# EAGLE design Adafruit PyPortal Pynt (EAGLE 9.4.2)

## Sheet 1 of 3
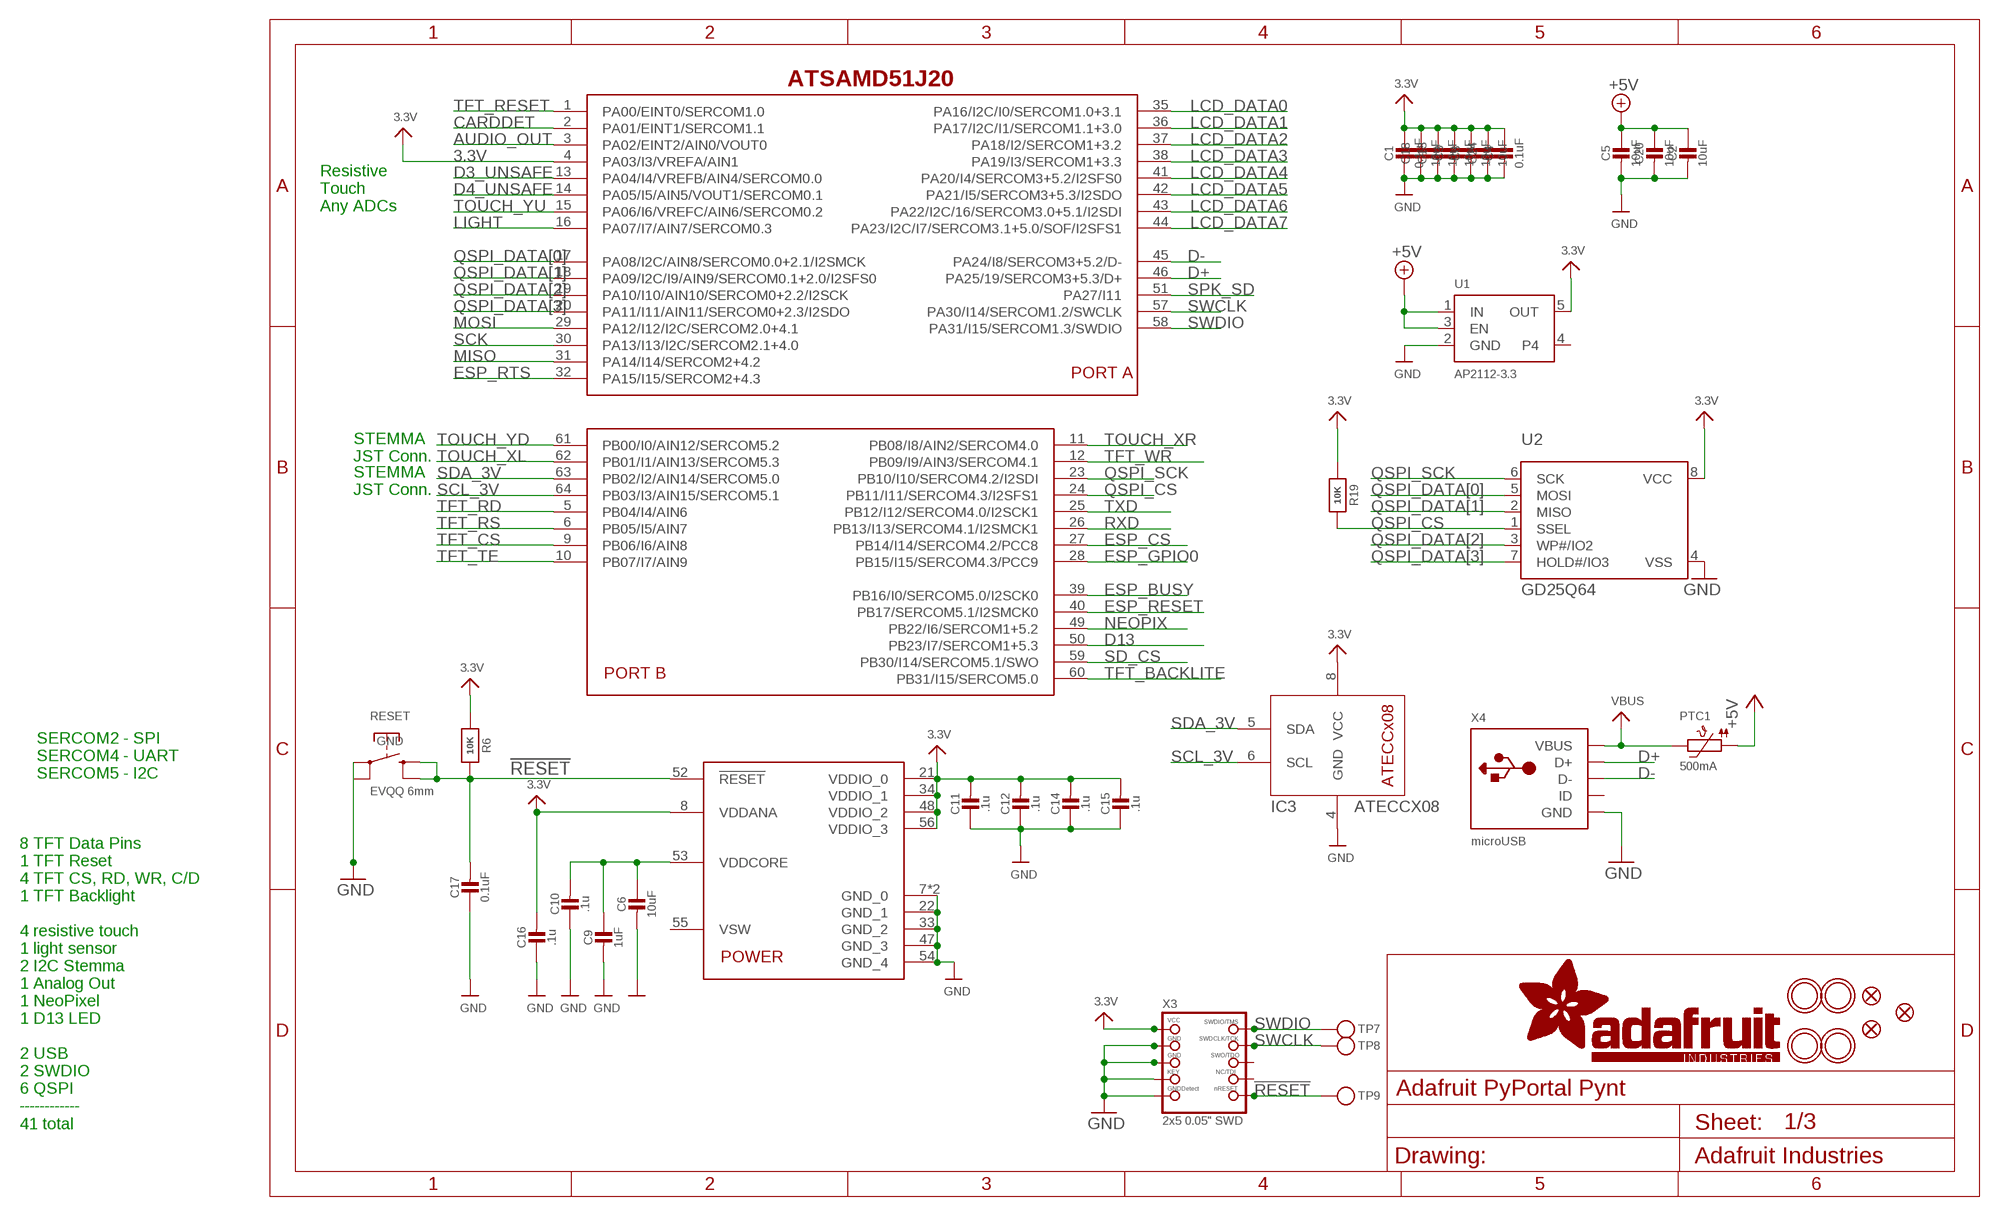
[diagram p0: schematic, sheet 1]

### Parts
C1  0.1uF  CAP_CERAMIC0603_NO  [0603-NO]
C2  10uF  CAP_CERAMIC0805-NOOUTLINE  [0805-NO]
C3  10uF  CAP_CERAMIC0805-NOOUTLINE  [0805-NO]
C4  0.1uF  CAP_CERAMIC0805-NOOUTLINE  [0805-NO]
C5  10uF  CAP_CERAMIC0805-NOOUTLINE  [0805-NO]
C6  10uF  CAP_CERAMIC0805-NOOUTLINE  [0805-NO]
C8  10uF  CAP_CERAMIC0805-NOOUTLINE  [0805-NO]
C9  1uF  CAP_CERAMIC0603_NO  [0603-NO]
C10  .1u  CAP_CERAMIC0603_NO  [0603-NO]
C11  .1u  CAP_CERAMIC0603_NO  [0603-NO]
C12  .1u  CAP_CERAMIC0603_NO  [0603-NO]
C13  10uF  CAP_CERAMIC0805-NOOUTLINE  [0805-NO]
C14  .1u  CAP_CERAMIC0603_NO  [0603-NO]
C15  .1u  CAP_CERAMIC0603_NO  [0603-NO]
C16  .1u  CAP_CERAMIC0603_NO  [0603-NO]
C17  0.1uF  CAP_CERAMIC0603_NO  [0603-NO]
C18  10uF  CAP_CERAMIC0805-NOOUTLINE  [0805-NO]
C20  10uF  CAP_CERAMIC0805-NOOUTLINE  [0805-NO]
C24  10uF  CAP_CERAMIC0805-NOOUTLINE  [0805-NO]
IC3  ATECCX08  [SOIC8_150MIL]
PTC1  500mA  PTC1206  [1206]
R6  10K  RESISTOR_0603_NOOUT  [0603-NO]
R19  10K  RESISTOR_0603_NOOUT  [0603-NO]
RESET  EVQQ 6mm  SWITCH_TACT_SMT_EVQQ2_SMALL  [EVQ-Q2_SMALLER]
TP7  TESTPOINTROUND1.5MM  [TESTPOINT_ROUND_1.5MM]
TP8  TESTPOINTROUND1.5MM  [TESTPOINT_ROUND_1.5MM]
TP9  TESTPOINTROUND1.5MM  [TESTPOINT_ROUND_1.5MM]
U1  AP2112-3.3  VREG_SOT23-5  [SOT23-5]
U2  GD25Q64  SPIFLASH_8PIN208MIL  [SOIC8_208MIL]
U$2  ATSAMD51J20  ATSAMD51J  [PQFN64-1]
U$7  MOUNTINGHOLE3.0THIN  [MOUNTINGHOLE_3.0_PLATEDTHIN]
U$9  FIDUCIAL_1MM  [FIDUCIAL_1MM]
U$11  FIDUCIAL_1MM  [FIDUCIAL_1MM]
U$15  MOUNTINGHOLE3.0THIN  [MOUNTINGHOLE_3.0_PLATEDTHIN]
U$16  MOUNTINGHOLE3.0THIN  [MOUNTINGHOLE_3.0_PLATEDTHIN]
U$17  MOUNTINGHOLE3.0THIN  [MOUNTINGHOLE_3.0_PLATEDTHIN]
U$23  FIDUCIAL_1MM  [FIDUCIAL_1MM]
X3  2x5 0.05" SWD  JTAG-CORTEX  [2X05_1.27MM_SMT]
X4  microUSB  USB_MICRO_NARROW  [4UCONN_20329_NARROW]

### Nets
3.3V [power]: C1.1 C3.1 C4.1 C8.1 C11.2 C12.2 C13.1 C14.2 C15.2 C16.2 C18.1 C24.1 IC3.8(VCC) R6.1 R19.1 U1.5(OUT) U2.8(VCC) U$2.4(PA03/I3/VREFA/AIN1) U$2.8(VDDANA) U$2.21(VDDIO_0) U$2.34(VDDIO_1) U$2.48(VDDIO_2) U$2.56(VDDIO_3) X3.1(VCC) ; also sheet 2,3
!RESET: C17.2 R6.2 RESET.B'(S1) RESET.B(S) TP9.P$1 U$2.52(!RESET) X3.10(NRESET)
+5V [power]: C2.1 C5.1 C20.1 PTC1.1 U1.1(IN) U1.3(EN) ; also sheet 2,3
AUDIO_OUT: U$2.3(PA02/EINT2/AIN0/VOUT0) ; also sheet 3
CARDDET: U$2.2(PA01/EINT1/SERCOM1.1) ; also sheet 2
D3_UNSAFE: U$2.13(PA04/I4/VREFB/AIN4/SERCOM0.0) ; also sheet 3
D4_UNSAFE: U$2.14(PA05/I5/AIN5/VOUT1/SERCOM0.1) ; also sheet 3
D13: U$2.50(PB23/I7/SERCOM1+5.3) ; also sheet 3
D+: U$2.46(PA25/19/SERCOM3+5.3/D+) X4.D+
D-: U$2.45(PA24/I8/SERCOM3+5.2/D-) X4.D-
ESP_BUSY: U$2.39(PB16/I0/SERCOM5.0/I2SCK0) ; also sheet 2
ESP_CS: U$2.27(PB14/I14/SERCOM4.2/PCC8) ; also sheet 2
ESP_GPIO0: U$2.28(PB15/I15/SERCOM4.3/PCC9) ; also sheet 2
ESP_RESET: U$2.40(PB17/SERCOM5.1/I2SMCK0) ; also sheet 2
ESP_RTS: U$2.32(PA15/I15/SERCOM2+4.3) ; also sheet 2
GND: C1.2 C2.2 C3.2 C4.2 C5.2 C6.2 C8.2 C9.2 C10.1 C11.1 C12.1 C13.2 C14.1 C15.1 C16.1 C17.1 C18.2 C20.2 C24.2 IC3.4(GND) RESET.A'(P1) RESET.A(P) U1.2(GND) U2.4(VSS) U$2.7(GND_0) U$2.22(GND_1) U$2.33(GND_2) U$2.47(GND_3) U$2.54(GND_4) U$2.EXP(GND_0) X3.3(GND) X3.5(GND) X3.7(KEY) X3.9(GNDDETECT) X4.BASE@1(GND) X4.BASE@2(GND) X4.GND X4.SPRT@1(GND) X4.SPRT@2(GND) X4.SPRT@3(GND) X4.SPRT@4(GND) ; also sheet 2,3
LCD_DATA0: U$2.35(PA16/I2C/I0/SERCOM1.0+3.1) ; also sheet 2
LCD_DATA1: U$2.36(PA17/I2C/I1/SERCOM1.1+3.0) ; also sheet 2
LCD_DATA2: U$2.37(PA18/I2/SERCOM1+3.2) ; also sheet 2
LCD_DATA3: U$2.38(PA19/I3/SERCOM1+3.3) ; also sheet 2
LCD_DATA4: U$2.41(PA20/I4/SERCOM3+5.2/I2SFS0) ; also sheet 2
LCD_DATA5: U$2.42(PA21/I5/SERCOM3+5.3/I2SDO) ; also sheet 2
LCD_DATA6: U$2.43(PA22/I2C/16/SERCOM3.0+5.1/I2SDI) ; also sheet 2
LCD_DATA7: U$2.44(PA23/I2C/I7/SERCOM3.1+5.0/SOF/I2SFS1) ; also sheet 2
LIGHT: U$2.16(PA07/I7/AIN7/SERCOM0.3) ; also sheet 3
MISO: U$2.31(PA14/I14/SERCOM2+4.2) ; also sheet 2
MOSI: U$2.29(PA12/I12/I2C/SERCOM2.0+4.1) ; also sheet 2
NEOPIX: U$2.49(PB22/I6/SERCOM1+5.2) ; also sheet 3
QSPI_CS: R19.2 U2.1(SSEL) U$2.24(PB11/I11/SERCOM4.3/I2SFS1)
QSPI_DATA[0]: U2.5(MOSI) U$2.17(PA08/I2C/AIN8/SERCOM0.0+2.1/I2SMCK)
QSPI_DATA[1]: U2.2(MISO) U$2.18(PA09/I2C/I9/AIN9/SERCOM0.1+2.0/I2SFS0)
QSPI_DATA[2]: U2.3(WP#/IO2) U$2.19(PA10/I10/AIN10/SERCOM0+2.2/I2SCK)
QSPI_DATA[3]: U2.7(HOLD#/IO3) U$2.20(PA11/I11/AIN11/SERCOM0+2.3/I2SDO)
QSPI_SCK: U2.6(SCK) U$2.23(PB10/I10/SERCOM4.2/I2SDI)
RXD: U$2.26(PB13/I13/SERCOM4.1/I2SMCK1) ; also sheet 2
SCK: U$2.30(PA13/I13/I2C/SERCOM2.1+4.0) ; also sheet 2
SCL_3V: IC3.6(SCL) U$2.64(PB03/I3/AIN15/SERCOM5.1) ; also sheet 3
SD_CS: U$2.59(PB30/I14/SERCOM5.1/SWO) ; also sheet 2
SDA_3V: IC3.5(SDA) U$2.63(PB02/I2/AIN14/SERCOM5.0) ; also sheet 3
SPK_SD: U$2.51(PA27/I11) ; also sheet 3
SWCLK: TP8.P$1 U$2.57(PA30/I14/SERCOM1.2/SWCLK) X3.4(SWDCLK)
SWDIO: TP7.P$1 U$2.58(PA31/I15/SERCOM1.3/SWDIO) X3.2(SWDIO)
TFT_BACKLITE: U$2.60(PB31/I15/SERCOM5.0) ; also sheet 2
TFT_CS: U$2.9(PB06/I6/AIN8) ; also sheet 2
TFT_RD: U$2.5(PB04/I4/AIN6) ; also sheet 2
TFT_RESET: U$2.1(PA00/EINT0/SERCOM1.0) ; also sheet 2
TFT_RS: U$2.6(PB05/I5/AIN7) ; also sheet 2
TFT_TE: U$2.10(PB07/I7/AIN9) ; also sheet 2
TFT_WR: U$2.12(PB09/I9/AIN3/SERCOM4.1) ; also sheet 2
TOUCH_XL: U$2.62(PB01/I1/AIN13/SERCOM5.3) ; also sheet 2
TOUCH_XR: U$2.11(PB08/I8/AIN2/SERCOM4.0) ; also sheet 2
TOUCH_YD: U$2.61(PB00/I0/AIN12/SERCOM5.2) ; also sheet 2
TOUCH_YU: U$2.15(PA06/I6/VREFC/AIN6/SERCOM0.2) ; also sheet 2
TXD: U$2.25(PB12/I12/SERCOM4.0/I2SCK1) ; also sheet 2
VBUS [power]: PTC1.2 X4.VBUS
VDDCORE: C6.1 C9.1 C10.2 U$2.53(VDDCORE)
Unconnected: U1.4 U$2.55(VSW) X3.6(SWO) X3.8(TDI) X4.ID

### Notes on the sheet
- ATSAMD51J20
- Resistive
  Touch
  Any ADCs
- STEMMA
  JST Conn.
- STEMMA
  JST Conn.
- SERCOM2 - SPI
  SERCOM4 - UART
  SERCOM5 - I2C
- 8 TFT Data Pins ✓
  1 TFT Reset
  4 TFT CS, RD, WR, C/D
  1 TFT Backlight
  
  4 resistive touch ✓
  1 light sensor ✓
  2 I2C Stemma ✓
  1 Analog Out
  1 NeoPixel
  1 D13 LED ✓
  
  2 USB ✓
  2 SWDIO ✓
  6 QSPI ✓
  ------------
  41 total

## Sheet 2 of 3
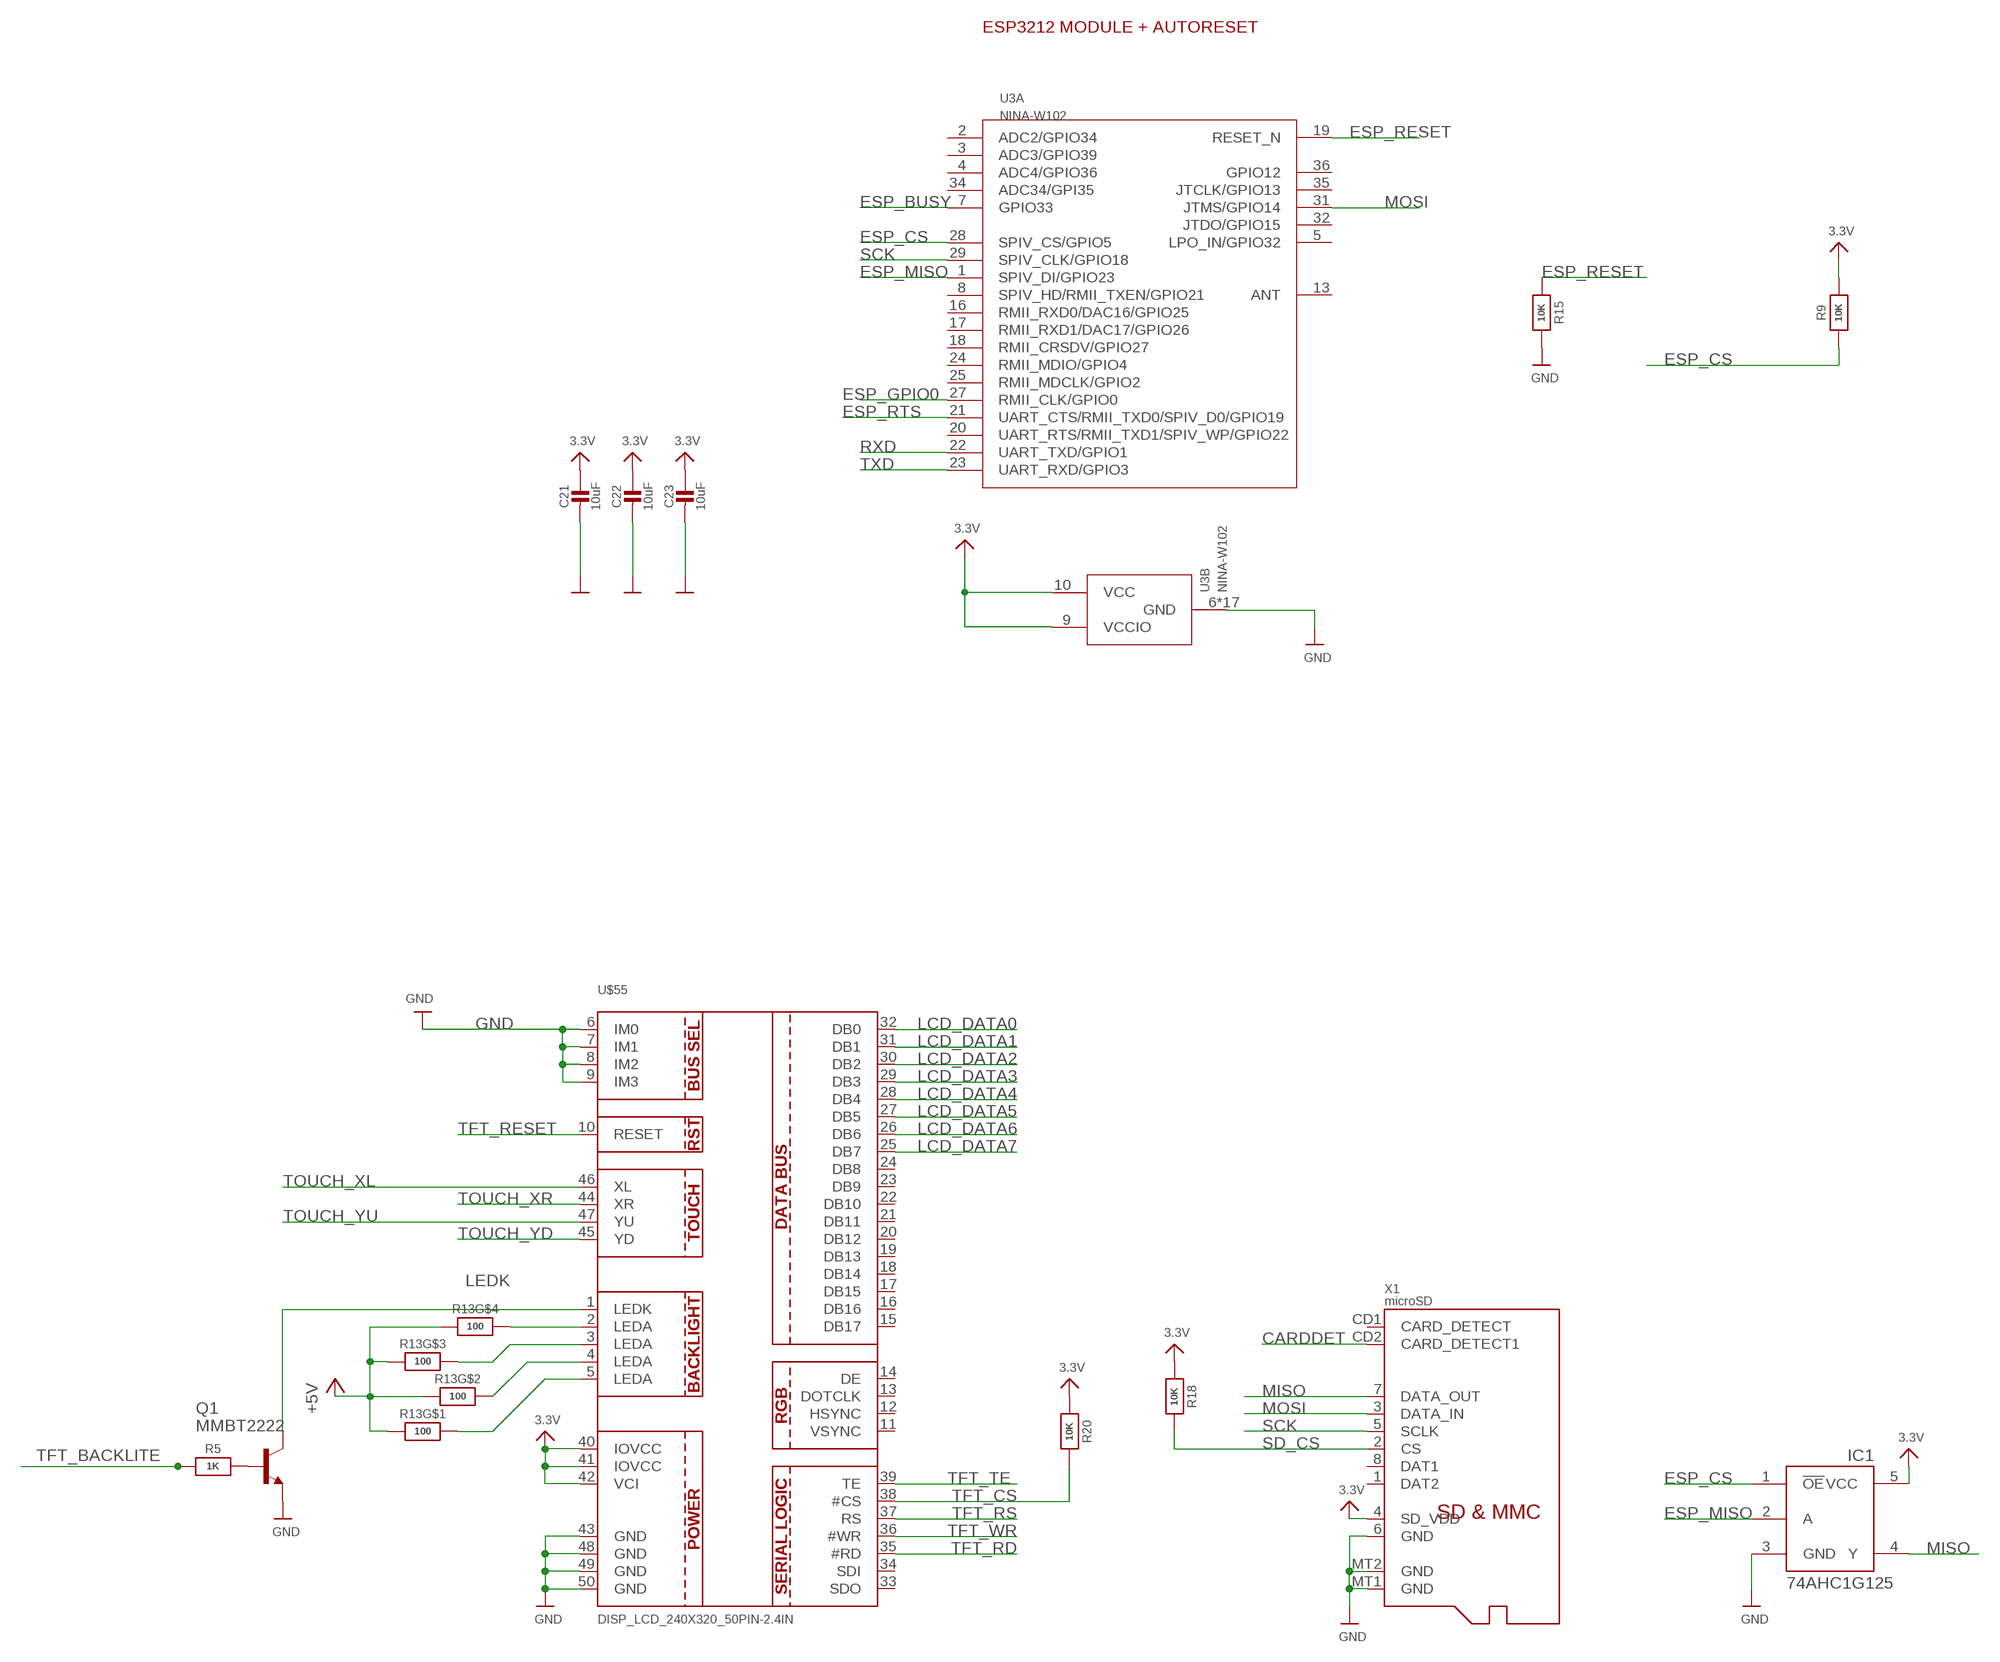
[diagram p1: schematic, sheet 2]

### Parts
C21  10uF  CAP_CERAMIC0805-NOOUTLINE  [0805-NO]
C22  10uF  CAP_CERAMIC0805-NOOUTLINE  [0805-NO]
C23  10uF  CAP_CERAMIC0805-NOOUTLINE  [0805-NO]
IC1  74AHC1G125  [SOT23-5L]
Q1  MMBT2222  MMBT2222ALT1-NPN-SOT23-BEC  [SOT23-BEC]
R5  1K  RESISTOR_0603_NOOUT  [0603-NO]
R9  10K  RESISTOR_0603_NOOUT  [0603-NO]
R13  100  RESISTOR_4PACK  [RESPACK_4X0603]
R15  10K  RESISTOR_0603_NOOUT  [0603-NO]
R18  10K  RESISTOR_0603_NOOUT  [0603-NO]
R20  10K  RESISTOR_0603_NOOUT  [0603-NO]
U3  NINA-W102  NINA-W10X-102NINA-W10X  [ARDUINO-UCS&SOCS_NINA-W1X]
U$55  DISP_LCD_240X320_50PIN-2.4IN  [TFT_2.4IN_240X320_50PIN]
X1  microSD  MICROSD  [MICROSD]

### Nets
3.3V [power]: C21.1 C22.1 C23.1 IC1.5(VCC) R9.2 R18.1 R20.1 U3.9(B:VCCIO) U3.10(B:VCC) U$55.40(IOVCC) U$55.41(IOVCC) U$55.42(VCI) X1.4(SD_VDD) ; also sheet 1,3
+5V [power]: R13.1 R13.2 R13.3 R13.4 ; also sheet 1,3
CARDDET: X1.CD2(CARD_DETECT1) ; also sheet 1
ESP_BUSY: U3.7(A:GPIO33) ; also sheet 1
ESP_CS: IC1.1(!OE) R9.1 U3.28(A:SPIV_CS/GPIO5) ; also sheet 1
ESP_GPIO0: U3.27(A:RMII_CLK/GPIO0) ; also sheet 1
ESP_MISO: IC1.2(A) U3.1(A:SPIV_DI/GPIO23)
ESP_RESET: R15.1 U3.19(A:RESET_N) ; also sheet 1
ESP_RTS: U3.21(A:UART_CTS/RMII_TXD0/SPIV_D0/GPIO19) ; also sheet 1
GND: C21.2 C22.2 C23.2 IC1.3(GND) Q1.E R15.2 U3.6(B:GND) U3.12(B:GND) U3.14(B:GND) U3.26(B:GND) U3.30(B:GND) U3.GND@1(B:GND) U3.GND@2(B:GND) U3.GND@3(B:GND) U3.GND@4(B:GND) U3.GND@5(B:GND) U3.GND@6(B:GND) U3.GND@7(B:GND) U3.GND@8(B:GND) U3.GND@9(B:GND) U3.GND@10(B:GND) U3.GND@11(B:GND) U3.GND@12(B:GND) U$55.6(IM0) U$55.7(IM1) U$55.8(IM2) U$55.9(IM3) U$55.43(GND) U$55.48(GND) U$55.49(GND) U$55.50(GND) X1.6(GND) X1.MT1(GND) X1.MT2(GND) ; also sheet 1,3
LCD_DATA0: U$55.32(DB0) ; also sheet 1
LCD_DATA1: U$55.31(DB1) ; also sheet 1
LCD_DATA2: U$55.30(DB2) ; also sheet 1
LCD_DATA3: U$55.29(DB3) ; also sheet 1
LCD_DATA4: U$55.28(DB4) ; also sheet 1
LCD_DATA5: U$55.27(DB5) ; also sheet 1
LCD_DATA6: U$55.26(DB6) ; also sheet 1
LCD_DATA7: U$55.25(DB7) ; also sheet 1
LEDK: Q1.C U$55.1(LEDK)
MISO: IC1.4(Y) X1.7(DATA_OUT) ; also sheet 1
MOSI: U3.31(A:JTMS/GPIO14) X1.3(DATA_IN) ; also sheet 1
N$1: R13.8 U$55.5(LEDA)
N$2: R13.5 U$55.2(LEDA)
N$3: R13.6 U$55.3(LEDA)
N$4: R13.7 U$55.4(LEDA)
N$16: Q1.B R5.2
RXD: U3.22(A:UART_TXD/GPIO1) ; also sheet 1
SCK: U3.29(A:SPIV_CLK/GPIO18) X1.5(SCLK) ; also sheet 1
SD_CS: R18.2 X1.2(CS) ; also sheet 1
TFT_BACKLITE: R5.1 ; also sheet 1
TFT_CS: R20.2 U$55.38(#CS) ; also sheet 1
TFT_RD: U$55.35(#RD) ; also sheet 1
TFT_RESET: U$55.10(RESET) ; also sheet 1
TFT_RS: U$55.37(RS) ; also sheet 1
TFT_TE: U$55.39(TE) ; also sheet 1
TFT_WR: U$55.36(#WR) ; also sheet 1
TOUCH_XL: U$55.46(XL) ; also sheet 1
TOUCH_XR: U$55.44(XR) ; also sheet 1
TOUCH_YD: U$55.45(YD) ; also sheet 1
TOUCH_YU: U$55.47(YU) ; also sheet 1
TXD: U3.23(A:UART_RXD/GPIO3) ; also sheet 1
Unconnected: U3.2(A:ADC2/GPIO34) U3.3(A:ADC3/GPIO39) U3.4(A:ADC4/GPIO36) U3.5(A:LPO_IN/GPIO32) U3.8(A:SPIV_HD/RMII_TXEN/GPIO21) U3.13(A:ANT) U3.16(A:RMII_RXD0/DAC16/GPIO25) U3.17(A:RMII_RXD1/DAC17/GPIO26) U3.18(A:RMII_CRSDV/GPIO27) U3.20(A:UART_RTS/RMII_TXD1/SPIV_WP/GPIO22) U3.24(A:RMII_MDIO/GPIO4) U3.25(A:RMII_MDCLK/GPIO2) U3.32(A:JTDO/GPIO15) U3.34(A:ADC34/GPI35) U3.35(A:JTCLK/GPIO13) U3.36(A:GPIO12) U$55.11(VSYNC) U$55.12(HSYNC) U$55.13(DOTCLK) U$55.14(DE) U$55.15(DB17) U$55.16(DB16) U$55.17(DB15) U$55.18(DB14) U$55.19(DB13) U$55.20(DB12) U$55.21(DB11) U$55.22(DB10) U$55.23(DB9) U$55.24(DB8) U$55.33(SDO) U$55.34(SDI) X1.1(DAT2) X1.8(DAT1) X1.CD1(CARD_DETECT)

### Notes on the sheet
- ESP3212 MODULE + AUTORESET

## Sheet 3 of 3
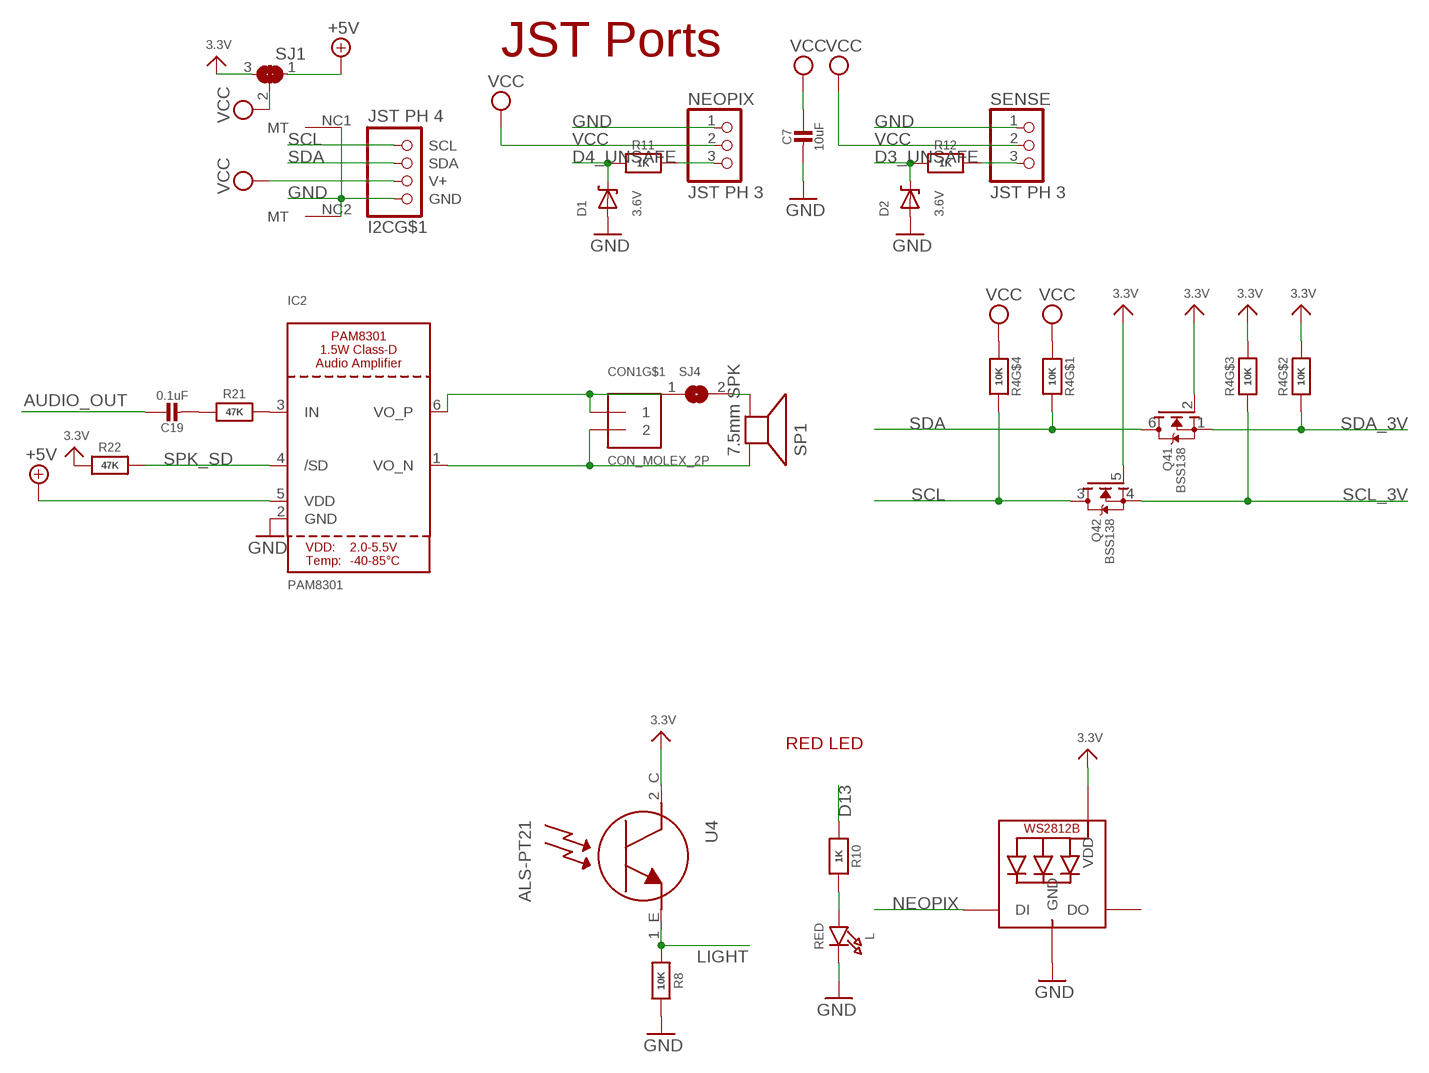
[diagram p2: schematic, sheet 3]

### Parts
C7  10uF  CAP_CERAMIC0805-NOOUTLINE  [0805-NO]
C19  0.1uF  CAP_CERAMIC0603_NO  [0603-NO]
CON1  CON_MOLEX_2P  [53398-0271]
D1  3.6V  DIODE-ZENERSOD323  [SOD-323]
D2  3.6V  DIODE-ZENERSOD323  [SOD-323]
I2C  JST PH 4  STEMMA_I2C_RASMT  [JSTPH4]
IC2  PAM8301  [SOT23-6]
L  RED  LED0805_NOOUTLINE  [CHIPLED_0805_NOOUTLINE]
LED1  WS2812B3535  [LED3535]
NEOPIX  JST PH 3  CON_JST_PH_3PIN  [JSTPH3]
Q4  BSS138  MOSFET-N_DUAL  [SOT363]
R4  10K  RESISTOR_4PACK  [RESPACK_4X0603]
R8  10K  RESISTOR_0603_NOOUT  [0603-NO]
R10  1K  RESISTOR_0603_NOOUT  [0603-NO]
R11  1K  RESISTOR_0603_NOOUT  [0603-NO]
R12  1K  RESISTOR_0603_NOOUT  [0603-NO]
R21  47K  RESISTOR_0603_NOOUT  [0603-NO]
R22  47K  RESISTOR_0603_NOOUT  [0603-NO]
SENSE  JST PH 3  CON_JST_PH_3PIN  [JSTPH3]
SJ1  SOLDERJUMPER_2WAY  [SOLDERJUMPER_2WAY_OPEN_NOPASTE]
SJ4  SOLDERJUMPERCLOSED  [SOLDERJUMPER_CLOSEDWIRE]
SP1  7.5mm SPK  SPEAKER_7.5MM  [BUZZER_SMT_7.5MM]
U4  ALS-PT21  PHOTOTRANSISTOR_PT26-21C  [ALS-PT26-21C]

### Nets
3.3V [power]: LED1.2(VDD) Q4.2(1:G) Q4.5(2:G) R4.2 R4.3 R22.1 SJ1.3 U4.2_C(C) ; also sheet 1,2
+5V [power]: IC2.5(VDD) SJ1.1 ; also sheet 1,2
AUDIO_OUT: C19.1 ; also sheet 1
D3: R12.1 SENSE.3
D3_UNSAFE: D2.C R12.2 ; also sheet 1
D4: NEOPIX.3 R11.1
D4_UNSAFE: D1.C R11.2 ; also sheet 1
D13: R10.1 ; also sheet 1
GND: C7.2 D1.A D2.A I2C.1(GND) I2C.NC1(MT) I2C.NC2(MT) IC2.2(GND) L.C LED1.4(GND) NEOPIX.1 R8.1 SENSE.1 ; also sheet 1,2
LIGHT: R8.2 U4.1_E(E) ; also sheet 1
N$8: L.A R10.2
N$10: C19.2 R21.1
N$11: IC2.3(IN) R21.2
N$13: SJ4.2 SP1.-
NEOPIX: LED1.1(DI) ; also sheet 1
SCL: I2C.4(SCL) Q4.3(2:D) R4.5
SCL_3V: Q4.4(2:S) R4.6 ; also sheet 1
SDA: I2C.3(SDA) Q4.6(1:D) R4.8
SDA_3V: Q4.1(1:S) R4.7 ; also sheet 1
SPK_SD: IC2.4(/SD) R22.2 ; also sheet 1
SPKR+: CON1.2 IC2.1(VO_N) SP1.+
SPRK-: CON1.1 IC2.6(VO_P) SJ4.1
VCC: C7.1 I2C.2(V+) NEOPIX.2 R4.1 R4.4 SENSE.2 SJ1.2
Unconnected: CON1.M1(MT) CON1.M2(MT) LED1.3(DO)

### Notes on the sheet
- JST Ports
- RED LED

## Library data of the parts
C1-C24 = microbuilder:CAP_CERAMIC: Ceramic Capacitors For new designs, use the packages preceded by an '_' character since they are more reliable: The following footprints should be used on most boards: _0402 - Standard footprint for regular board layouts _0603 - Standard footprint for regular board layouts _0805 - Standard footprint for regular board layouts _1206 - Standard footprint for regular board layouts For extremely tight-pitch boards where space is at a premium, the following 'micro-pitch' footprints can be used (smaller pads, no silkscreen outline, etc.): _0402MP - Micro-pitch footprint for very dense/compact boards _0603MP - Micro-pitch footprint for very dense/compact boards _0805MP - Micro-pitch footprint for very dense/compact boards _1206MP - Micro-pitch footprint for very dense/compact boards
CON1 = microbuilder:CON_MOLEX_2P
D1 D2 = microbuilder:DIODE-ZENER: Zener Diode SMA: 30V 1W Zener Diode, 1.2Vf - Digikey: SMAZ30-FDICT-ND
I2C = microbuilder:STEMMA_I2C
IC1 = adafruit:74AHC1G125
IC2 = microbuilder:PAM8301
IC3 = microbuilder:ATECCX08
L = microbuilder:LED: LED 0603 - 0603 Surface Mount Package 2mA: Green LED - Low Power (3.9mcd, 2ma, 1.7Vf) - Digikey: 475-2709-2-ND Orange LED - Low Power (9.8mcd, 2ma, 1.8Vf) - Digikey: 475-1194-2-ND Red LED - Low Power (5mcd, 2ma, 1.8Vf) - Digikey: 475-1195-2-ND Yellow LED - Low Power (7mcd, 2ma, 1.8Vf) - Digikey: 475-1196-2-ND 5mA: Blue LED - Low Power (17mcd, 5ma, 2.9Vf) - Digikey: LNJ937W8CRACT-ND 0805 - 0805 Surface Mount Package 2mA: Red LED (8.8mcd, 2mA, 1.8Vf, Clear) - Low Power [Digikey: 475-2510-1-ND] Green LED (5mcd, 2mA, 1.8Vf, Clear) - Low Power [Digikey: 475-2730-1-ND] Yellow LED (11.3mcd, 2mA, 1.8Vf, Clear) - Low Power [Digikey: 475-2555-1-ND] 20mA: Red LED (104mcd, 20mA, Diffused) - LS R976 [Digikey: 475-1278-6-ND] Red LED (12mcd, 20mA, 2.0Vf, Clear) - APT2012EC [Digikey: 754-1128-1-ND] Green LED (15mcd, 20mA, 2.2Vf, Clear) - APT2012GC [Digikey: 754-1131-1-ND] Orange LED (160mcd, 20mA, 2.1Vf, Clear) - APT2012SECK [Digikey: 754-1130-1-ND] 1206 - 1206 Surface Mount Package Green LED (26mcd, 20mA, Diffused) - LG N971 [Digikey: 475-1407-6-ND] Red LED (15mcd, 20mA, Diffused) - LH N974 [Digikey: 475-1416-6-ND] Cree - Cree High-Power Surface Mount LEDs XPEBWT-L1-0000-00D50 - White 111lm 350mA 2.9Vf 6200K 110° XTEAWT-00-0000-00000LEE3 - White 114lm 350mA 2.85Vf 5000K 115° Everlight - Everlight 45-21 Series Surface Mount LEDs 45-21/QK2C-B2832AC2CB2/2T - Warm White 2000mcd 20mA 3.25Vf 3050K 120° 45-21/LK2C-B38452C4CB2/2T - Nuetral White 2000mcd 20mA 3.25Vf 4150K 120° 45-21/LK2C-B50634C6CB2/2T - Cold White 2200mcd 20mA 3.25Vf 5650K 120° PLCC2 Reverse Mount LS T77K-J1L2-1-0-2-R18-Z - Red 11.25mcd 2mA 1.8Vf 630nm 120° LO T77K-L1M2-24-Z - Orange 19.6mcd 2mA 1.8Vf 606nm 120° LY T77K-K2M1-26-Z - Yellow 15.7mcd 2mA 1.8Vf 587nm 120°
LED1 = microbuilder:WS2812B
NEOPIX SENSE = microbuilder:CON_JST_PH_3PIN
PTC1 = microbuilder:PTC: PTC (Resettable Fuse) 1206 Package 250mA PTC (16V Max, Time-to-Trip: 0.08s) - Digikey: F2110CT-ND 1210 Package 100mA PTC (30V Max, Time-to-Trip: 0.6s) - Digikey: MF-USMF010-2CT-ND 1812 Package 750mA PTC (24V Max, Time-to-Trip: 0.2s) - Digikey: MF-MSMF075/24-2CT-ND
Q1 = transistor-neu-to92:*-NPN-: NPN Transistror
Q4 = microbuilder:MOSFET-N_DUAL: Dual N-Channel MOSFET SOT363 (2.0x1.25mm) 2N7002PS - 60V, 320mA [Digikey: 568-5984-1-ND]
R4 R13 = microbuilder:RESISTOR_4PACK: Resistor Packs (4 resistors) 4 x 0603 10K 1/16W - Digikey: YC164J-10KCT-ND
R5 R6 R8-R12 R15 R18-R22 = microbuilder:RESISTOR: Resistors For new designs, use the packages preceded by an '_' character since they are more reliable: The following footprints should be used on most boards: _0402 - Standard footprint for regular board layouts _0603 - Standard footprint for regular board layouts _0805 - Standard footprint for regular board layouts _1206 - Standard footprint for regular board layouts For extremely tight-pitch boards where space is at a premium, the following 'micro-pitch' footprints can be used (smaller pads, no silkscreen outline, etc.): _0402MP - Micro-pitch footprint for very dense/compact boards _0603MP - Micro-pitch footprint for very dense/compact boards _0805MP - Micro-pitch footprint for very dense/compact boards _1206MP - Micro-pitch footprint for very dense/compact boards
RESET = microbuilder:SWITCH_TACT_SMT: SMT Tact Switches 6x6mm - Digikey: P12940SCT-ND KMR2 (4.6x2.8mm) - Digikey: 401-1426-1-ND EVQ-PQHB55 - Light Touch, 160GF (4.5x4.5mm) - Digikey: P8090SCT-ND KMT0 - KMT021 NGJ LHS (etc.) IP68/Waterproof - Digikey: CKN10289CT-ND
SJ1 = microbuilder:SOLDERJUMPER_2WAY: 2-Way Solder Jumper
SJ4 = microbuilder:SOLDERJUMPER: SMD Solder JUMPER Solder the two pads together to create a connection, or remove the solder to break it. REFLOW - Use this footprint for solder paste and reflow ovens. WAVE - Use this footprint for hand-soldering (larger pads). CLOSED - Has a trace between the two pads to ensure it is closed by default. The trace needs to be cut to disable the jumper, and can be closed again by creating a solder bridge between the two pads.
SP1 = microbuilder:SPEAKER: SPEAKER Source: Buerklin Added PS12 (for part # PS1240 piezo) http://www.ladyada.net/library/pcb/eaglelibrary.html
TP7-TP9 = microbuilder:TESTPOINT: Test Point Various test points for characterisation and PCB testing TESTPOINT_SMT - Compact Surface Mount Test Point [Digikey: 5016KTR-ND]
U1 = microbuilder:VREG_SOT23-5: SOT23-5 Fixed Voltage Regulators Part Current Out V Out V In V Dropout θJA (°C/W) TJ (°C) Digikey Part No. ADP121 150mA 3.3V 3.4-5.5V 0.09V @ 150mA -- -- ADP121-AUJZ33R7CT-ND ADP121 150mA 3.0V 3.1-5.5V 0.09V @ 150mA -- -- ADP121-AUJZ30R7CT-ND ADP122 300mA 3.3V 3.4-5.5V 0.085V @ 300mA -- -- ADP122AUJZ-3.3-R7CT-ND ADP1712 300mA 3.3V 3.5-5.5V 0.17V @ 300mA -- -- ADP1712AUJZ-3.3-R7TR-ND AP7311 (Low Cost) 150mA 3.3V 3.5-6V 0.15V @ 150mA -- -- AP7311-33WG-7DICT-ND LD39015M18R 150mA 1.8V 1.9V-5.5V 0.08V @ 100mA -- -- 497-6977-1-ND LP2985A-33DBVR 150mA 3.3V 3.3-16V 0.28V @ 150mA 206 150 296-18479-1-ND MCP1824T-3302E/OT 300mA 3.3V 3.5V-6V 0.2V @ 300mA -- -- MCP1824T-3302E/OTCT-ND MIC5205-2.5YM5 TR 150mA 2.5V 2.7-16V 0.165V @ 150mA -- -- 576-1257-2-ND MIC5205-3.0YM5 TR 150mA 3.0V 3.2V-16V 0.165V @ 150mA -- -- 576-1258-2-ND MIC5205-3.3YM5 TR 150mA 3.3V 3.5V-16V 0.165V @ 150mA -- -- 576-1259-2-ND TPS780330220 150mA 3.3V+2.2V 3.6-5.5V 250mV Max -- -- 296-23332-1-ND TDA3663/N1,135 100mA 3.3V 3.5-45V 0.18V @ 50mA -- -- 568-5343-1-ND Max operating temp can be calculated using θJA, TJ (max junction temperature), and power in watts. Set the "Maximum Ambient Temperature" until it reaches TJ ("Max Junction Temperature"), which is the absolute limit for safe use of the regulator: Heat Sink Temperature Calculator <http://www.daycounter.com/Calculators/Heat-Sink-Temperature-Calculator.phtml> For example, With 12V source into a 3.3V LP2985 and a 30mA load, we are dissipating (12V-3.3V) * 0.03A = 0.261W. With a θJA of 206 °C/W, a TJ of 150°C, and 261mW we can safely use the chip without a heat sink up to 75°C (=147.1°C Junction Temperature).
U2 = microbuilder:SPIFLASH_8PIN: SOIC8 SPI Flash Be careful with the size since SOIC8 flash comes in several 'widths' SOIC8 150 mil M25P16 - 16Mbit (2Mbit x 8) Serial Flash (75MHz SPI Bus), Supply: 2.7-3.6V Digikey: SOIC8 - M25P16-VMN6P-ND SOIC8 208 mil W25Q16BVSSIG - 16Mbit (2Mbit x 8) Serial Flash (104MHz SPI Bus), Supply: 2.7-3.6V Digikey: SOIC8 - W25Q16BVSSIG-ND
U3 = microbuilder:NINA-W10X: uBlox NINA-W10X ESP32 WiFi/BLE module Footprint, Symbol, and Object by Arturo Guadalupi for the Arduino MKRWiFi1010 https://content.arduino.cc/assets/MKRWiFi1010-reference.zip BY-SA; CODE-ARDUINO: 2205; DATASHEET: https://www.u-blox.com/sites/default/files/NINA-W1_DataSheet_%28UBX-17006694%29.pdf; DISTRIBUTOR-LINK: https://www.digikey.com/product-detail/en/u-blox-america-inc/NINA-W102/672-1070-1-ND/7931820; DISTRIBUTOR-PN: 672-1070-1-ND; MANUFACTURER: Ublocks; MANUFACTURER-PN: NINA-W102
U4 = microbuilder:PHOTOTRANSISTOR: ALS-PT19-315C - Analog Light Sensor VCC: 2.5-5.5V
U$2 = microbuilder:ATSAMD51J: ATSAMD51J cortex m4 microcontroller
U$7 U$15-U$17 = microbuilder:MOUNTINGHOLE: Mounting Hole For #2 screws (0.086"/2.18mm width, 0.094"/2.4mm hole) use 2.5mm; BOM: EXCLUDE
U$9 U$11 U$23 = microbuilder:FIDUCIAL: Fiducial Alignment Points Various fiducial points for machine vision alignment.; BOM: EXCLUDE
U$55 = microbuilder:DISP_LCD_240X320_50PIN
X1 = microbuilder:MICROSD: MicroSD/Transflash Card Holder with SPI pinout 3M: 2908-05WB-MG 4UConnector: 19656 Footprint courtesy: Adafruit Industries
X3 = microbuilder:JTAG-CORTEX: Serial Wire (SW-DP) Connector Standard 0.05" 10-pin connector is for use with the Cortex M and Cortex A SWD (serial wire debugger) interface (SW-DP) Connectors 2x05_1.27MM_SMT - Inexpensive surface-mount header with bare pins, compatible with standard 10-pin SWD cables (4UCON: 16846) 2x05_1.27MM_BOX_NOPOSTS - Polarised surface-mount box (4UCON with caps: 19735, without caps: 15117 2x05_1.27MM_BOX_POSTS - Polarised surface-mount box with mounting holes (4UCON: 20317) Pinout: http://infocenter.arm.com/help/topic/com.arm.doc.faqs/attached/13634/cortex_debug_connectors.pdf http://www.keil.com/peripherals/coresight/connectors.asp
X4 = microbuilder:USB: USB Connectors USBMINIB - Surface Mount Female Mini-B USB Connector 4UConnector: 06564

## Net classes
1 power: width 0.305 mm

## Board
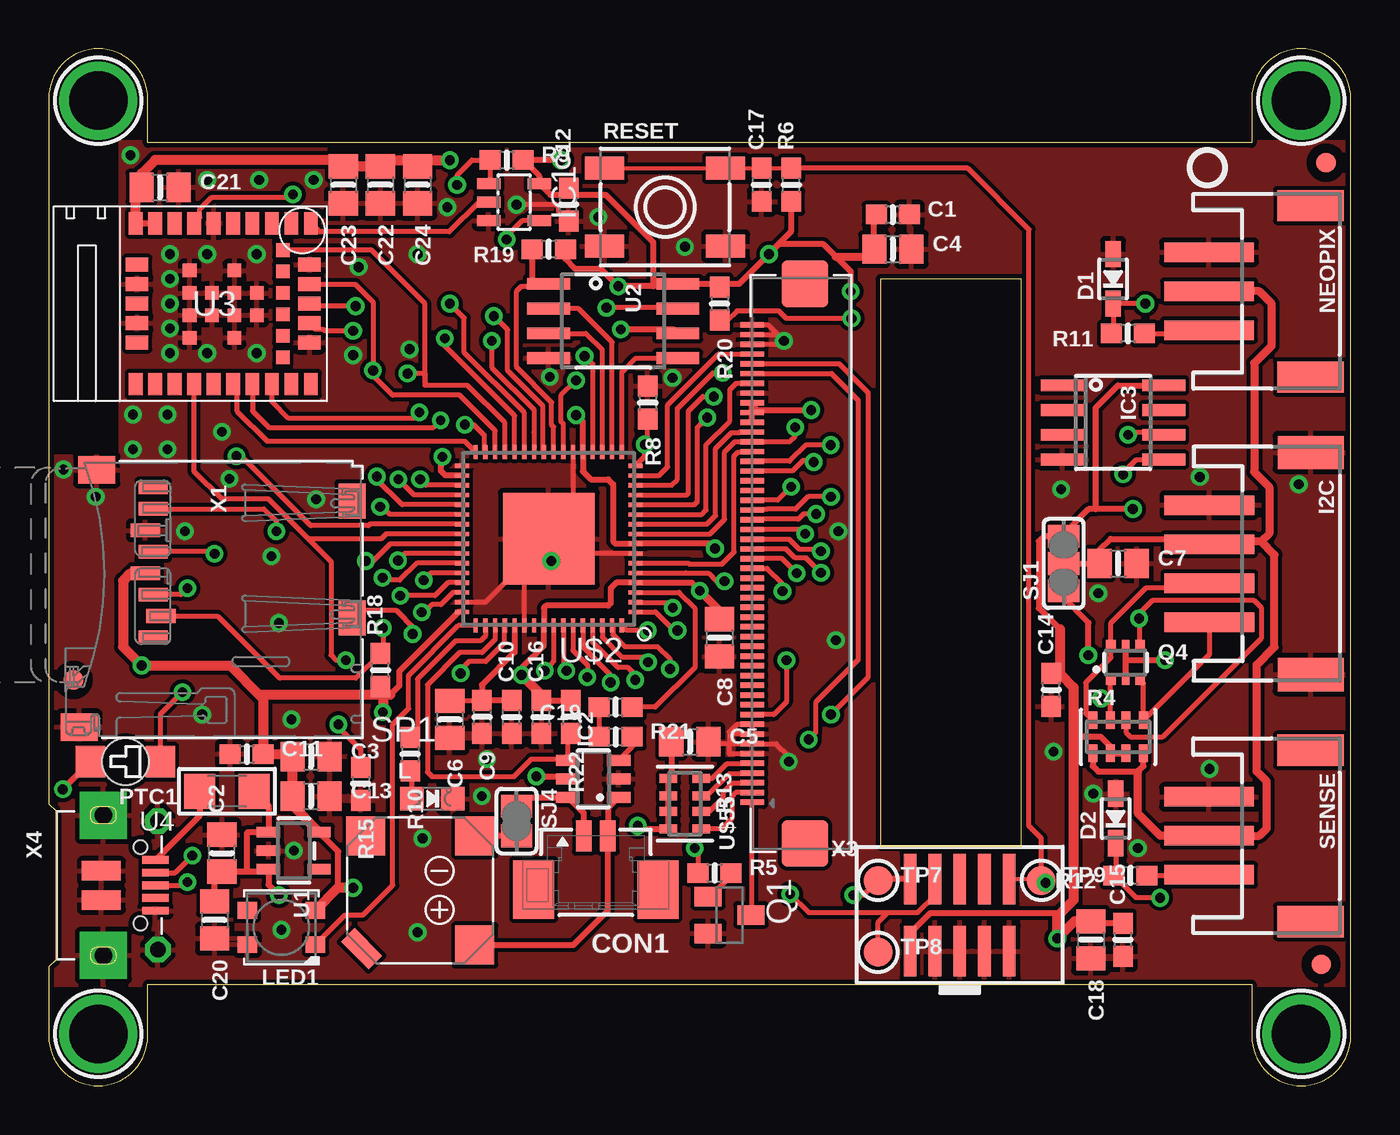
[diagram p3: board, top side]
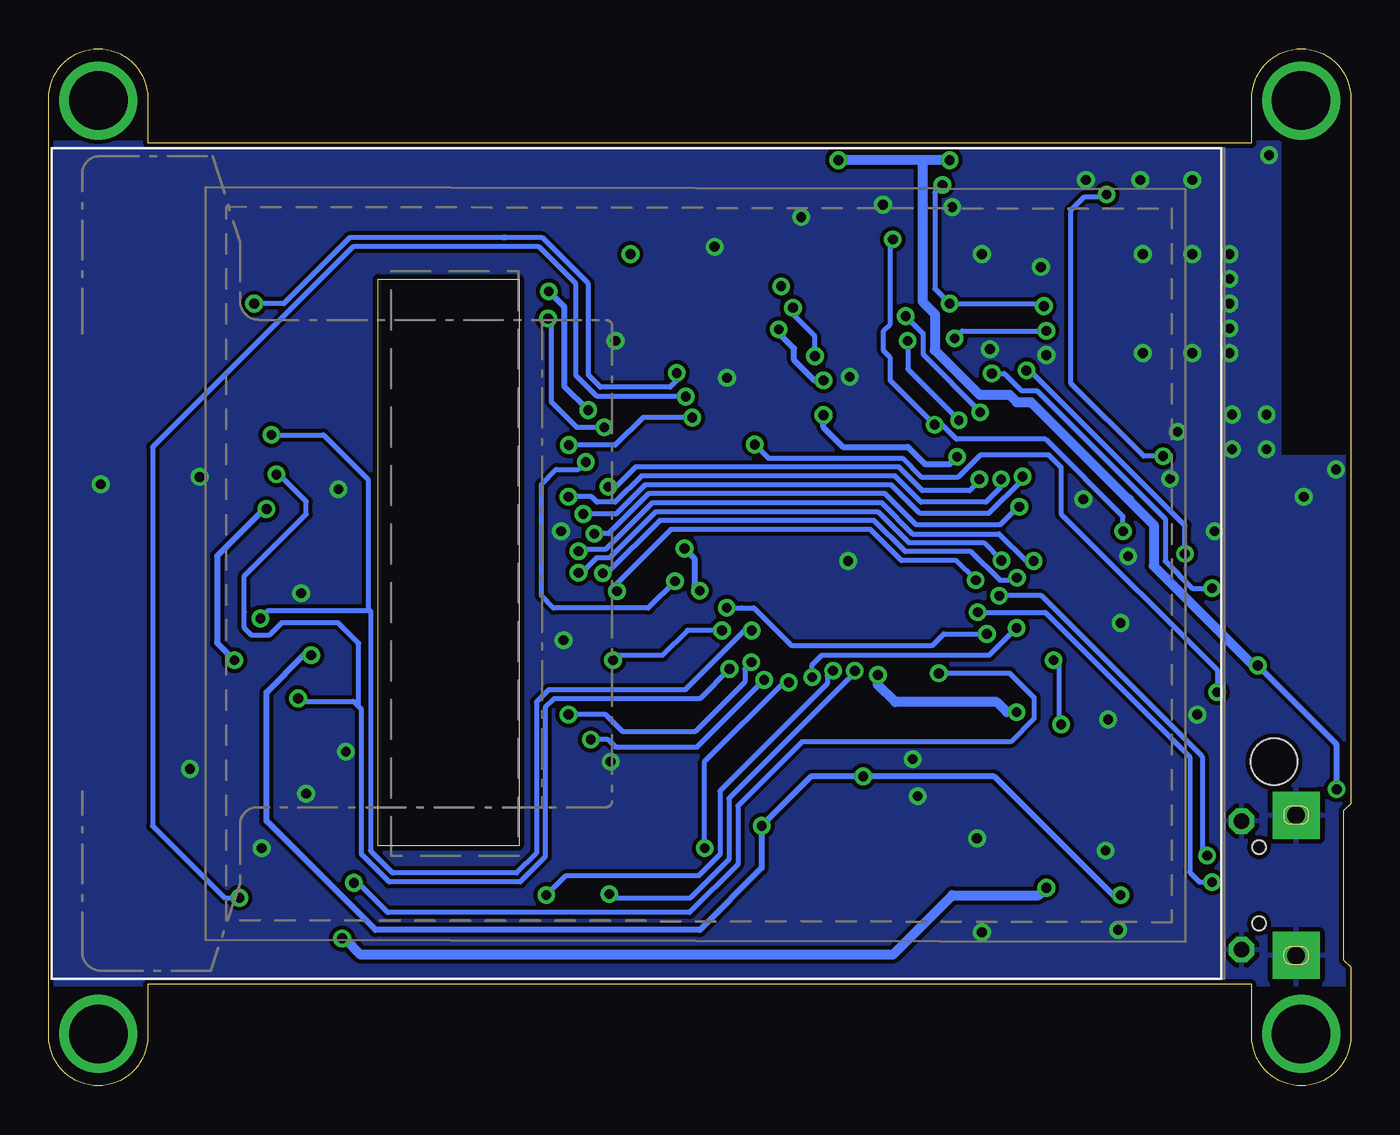
[diagram p4: board, bottom side, seen from below]

Size 66.8 x 53.21 mm. Coordinates in mm from the lower left corner, seen from the top.
Outline: 64.26,0 arc90 66.8,2.54 66.8,50.67 arc90 64.26,53.21 arc90 61.72,50.67 61.72,48.39 5.08,48.39 5.08,50.67 arc90 2.54,53.21 arc90 0,50.67 0,14.48 0.38,14.1 0.38,6.48 0,6.1 0,2.54 arc90 2.54,0 arc90 5.08,2.54 5.08,5.21 61.72,5.21 61.72,2.54 arc90 64.26,0
Outline: 42.67,12.32 49.91,12.32 49.91,41.4 42.67,41.4 42.67,12.32
Copper layers (1*16): Top 0.035mm / dielectric 1.5mm / Bottom 0.035mm
Design rules "adafruit *": minimum track width 8mil, minimum drill 19mil, track to track 8mil, track to pad 8mil, pad to pad 8mil, via to via 8mil, smd to smd 8mil, copper to edge 10mil, drill to drill 8mil, minimum pad ring 10mil, minimum via ring 8mil, stop-mask expansion 4mil, vias tented up to drill 20mil, thermal gap 10mil

### Footprints (pad centres in the part's own frame; a part is rotated, then mirrored left to right if it is on the bottom)
0603-NO = smd 1.075 x 1: 1 -0.85,0; 2 0.85,0
0805-NO = smd 1.24 x 1.5: 1 -0.95,0; 2 0.95,0
53398-0271 = smd 0.8 x 1.6: 1 0.625,-1.27; 2 -0.625,-1.27 | smd 2.1 x 3: M1 3.185,1.48; M2 -3.185,1.48
SOD-323 = smd 1.35 x 0.8: A 1.27,0; C -1.27,0
JSTPH4 = smd 1 x 4.6: 1 -3,-3.7; 2 -1,-3.7; 3 1,-3.7; 4 3,-3.7 | smd 1.7 x 3.4: NC1 -5.7,1.5; NC2 5.7,1.5
SOT23-5L = smd 0.55 x 1.2: 1 -0.95,-1.3; 2 0,-1.3; 3 0.95,-1.3; 4 0.95,1.3; 5 -0.95,1.3
SOT23-6 = smd 0.55 x 1.2: 1 -0.95,-1.3; 2 0,-1.3; 3 0.95,-1.3; 4 0.95,1.3; 5 0,1.3; 6 -0.95,1.3
SOIC8_150MIL = smd 0.6 x 2.2: 1 -1.905,-2.6; 2 -0.635,-2.6; 3 0.635,-2.6; 4 1.905,-2.6; 5 1.905,2.6; 6 0.635,2.6; 7 -0.635,2.6; 8 -1.905,2.6
CHIPLED_0805_NOOUTLINE = smd 1.2 x 1.2: A 0,-1.05; C 0,1.05
LED3535 = smd 1 x 0.85: 1 -1.75,0.875; 2 -1.75,-0.875; 3 1.75,-0.875; 4 1.75,0.875
JSTPH3 = smd 1 x 4.6: 1 -2,-2.7; 2 0,-2.7; 3 2,-2.7 | smd 1.6 x 3.4: NC1 -4.4,2.5; NC2 4.4,2.5
1206 = smd 1.6 x 1.8: 1 -1.4,0; 2 1.4,0
SOT23-BEC = smd 1 x 1.4: B -0.95,-1.1; C 0,1.1; E 0.95,-1.1
SOT363 = smd 0.5 x 0.5: 1 -0.75,-0.9; 3 0.75,-0.9; 4 0.75,0.9; 6 -0.75,0.9 | smd 0.4 x 0.5: 2 0,-0.9; 5 0,0.9
RESPACK_4X0603 = smd 0.45 x 0.9: 1 -1.3,-0.85; 2 -0.4,-0.85; 3 0.4,-0.85; 4 1.3,-0.85; 5 1.3,0.85; 6 0.4,0.85; 7 -0.4,0.85; 8 -1.3,0.85
EVQ-Q2_SMALLER = smd 2 x 1.2: A -3.1,-2; A' 3.1,-2; B -3.1,2; B' 3.1,2
SOLDERJUMPER_2WAY_OPEN_NOPASTE = smd 1.168 x 1.6: 1 -1.397,0; 2 0,0; 3 1.397,0
SOLDERJUMPER_CLOSEDWIRE = smd 1.168 x 1.6: 1 -0.762,0; 2 0.762,0 | smd 0.635 x 0.203: WIRE 0,0
BUZZER_SMT_7.5MM = smd 2 x 2: + 2.8,-2.8; - 2.8,2.8; MT2 -2.8,2.8 | smd 2 x 1 rotated 135: MT -3,-3
TESTPOINT_ROUND_1.5MM = smd 1.5 x 1.5: P$1 0,0
SOT23-5 = smd 0.55 x 1.2: 1 -0.95,-1.3; 2 0,-1.3; 3 0.95,-1.3; 4 0.95,1.3; 5 -0.95,1.3
SOIC8_208MIL = smd 0.6 x 2.2: 1 -1.905,-3.315; 2 -0.635,-3.315; 3 0.635,-3.315; 4 1.905,-3.315; 5 1.905,3.315; 6 0.635,3.315; 7 -0.635,3.315; 8 -1.905,3.315
ARDUINO-UCS&SOCS_NINA-W1X = smd 0.7 x 1.15: 1 4.95,4.125; 2 3.95,4.125; 3 2.95,4.125; 4 1.95,4.125; 5 0.95,4.125; 6 -0.05,4.125; 7 -1.05,4.125; 8 -2.05,4.125; 9 -3.05,4.125; 10 -4.05,4.125; 16 -4.05,-4.125; 17 -3.05,-4.125; 18 -2.05,-4.125; 19 -1.05,-4.125; 20 -0.05,-4.125; 21 0.95,-4.125; 22 1.95,-4.125; 23 2.95,-4.125; 24 3.95,-4.125; 25 4.95,-4.125 | smd 1.15 x 0.7: 11 -3.975,2; 12 -3.975,1; 13 -3.975,0; 14 -3.975,-1; 15 -3.975,-2; 26 4.875,-2; 27 4.875,-1; 28 4.875,0; 29 4.875,1; 30 4.875,2 | smd 0.7 x 0.7: 31 3.5,2.75; 32 3.5,1.65; 33 3.5,0.55; 34 3.5,-0.55; 35 3.5,-1.65; 36 3.5,-2.75; GND@1 -1.28,1.7; GND@2 -1.28,0.55; GND@3 -1.28,-0.6; GND@4 -1.28,-1.75; GND@5 -0.13,0.55; GND@6 -0.13,-0.6; GND@7 1.02,1.7; GND@8 1.02,0.55; GND@9 1.02,-0.6; GND@10 1.02,-1.75; GND@11 2.17,0.55; GND@12 2.17,-0.6
ALS-PT26-21C = smd 1.5 x 1.6: 1_E -1.8,0; 2_C 1.8,0 | hole 2.4: 0,0
PQFN64-1 = smd 0.7 x 0.22: 1 -4.45,3.75; 2 -4.45,3.25; 3 -4.45,2.75; 4 -4.45,2.25; 5 -4.45,1.75; 6 -4.45,1.25; 7 -4.45,0.75; 8 -4.45,0.25; 9 -4.45,-0.25; 10 -4.45,-0.75; 11 -4.45,-1.25; 12 -4.45,-1.75; 13 -4.45,-2.25; 14 -4.45,-2.75; 15 -4.45,-3.25; 16 -4.45,-3.75; 33 4.45,-3.75; 34 4.45,-3.25; 35 4.45,-2.75; 36 4.45,-2.25; 37 4.45,-1.75; 38 4.45,-1.25; 39 4.45,-0.75; 40 4.45,-0.25; 41 4.45,0.25; 42 4.45,0.75; 43 4.45,1.25; 44 4.45,1.75; 45 4.45,2.25; 46 4.45,2.75; 47 4.45,3.25; 48 4.45,3.75 | smd 0.22 x 0.7: 17 -3.75,-4.45; 18 -3.25,-4.45; 19 -2.75,-4.45; 20 -2.25,-4.45; 21 -1.75,-4.45; 22 -1.25,-4.45; 23 -0.75,-4.45; 24 -0.25,-4.45; 25 0.25,-4.45; 26 0.75,-4.45; 27 1.25,-4.45; 28 1.75,-4.45; 29 2.25,-4.45; 30 2.75,-4.45; 31 3.25,-4.45; 32 3.75,-4.45; 49 3.75,4.45; 50 3.25,4.45; 51 2.75,4.45; 52 2.25,4.45; 53 1.75,4.45; 54 1.25,4.45; 55 0.75,4.45; 56 0.25,4.45; 57 -0.25,4.45; 58 -0.75,4.45; 59 -1.25,4.45; 60 -1.75,4.45; 61 -2.25,4.45; 62 -2.75,4.45; 63 -3.25,4.45; 64 -3.75,4.45 | smd 4.7 x 4.7: EXP 0,0
MOUNTINGHOLE_3.0_PLATEDTHIN = drill 3 pad 3.6: P$1 0,0
FIDUCIAL_1MM = smd 1 x 1: 1 0,0
TFT_2.4IN_240X320_50PIN = smd 0.275 x 1.2 bottom: 1 12.25,28.551; 2 11.75,28.551; 3 11.25,28.551; 4 10.75,28.551; 5 10.25,28.551; 6 9.75,28.551; 7 9.25,28.551; 8 8.75,28.551; 9 8.25,28.551; 10 7.75,28.551; 11 7.25,28.551; 12 6.75,28.551; 13 6.25,28.551; 14 5.75,28.551; 15 5.25,28.551; 16 4.75,28.551; 17 4.25,28.551; 18 3.75,28.551; 19 3.25,28.551; 20 2.75,28.551; 21 2.25,28.551; 22 1.75,28.551; 23 1.25,28.551; 24 0.75,28.551; 25 0.25,28.551; 26 -0.25,28.551; 27 -0.75,28.551; 28 -1.25,28.551; 29 -1.75,28.551; 30 -2.25,28.551; 31 -2.75,28.551; 32 -3.25,28.551; 33 -3.75,28.551; 34 -4.25,28.551; 35 -4.75,28.551; 36 -5.25,28.551; 37 -5.75,28.551; 38 -6.25,28.551; 39 -6.75,28.551; 40 -7.25,28.551; 41 -7.75,28.551; 42 -8.25,28.551; 43 -8.75,28.551; 44 -9.25,28.551; 45 -9.75,28.551; 46 -10.25,28.551; 47 -10.75,28.551; 48 -11.25,28.551; 49 -11.75,28.551; 50 -12.25,28.551 | smd 2.4 x 2.4 bottom: PAD1 14.35,25.851; PAD2 -14.35,25.851
MICROSD = smd 0.7 x 1.5: 1 9,-10.64; 2 7.9,-10.24; 3 6.8,-10.64; 4 5.7,-11.04; 5 4.6,-10.64; 6 3.5,-11.04; 7 2.4,-10.64; 8 1.3,-10.64 | smd 1.8 x 1.4: CD1 2,-0.44; CD2 8,-0.44 | smd 1.4 x 1.9: MT1 0.4,-13.54; MT2 13.6,-14.44
2X05_1.27MM_SMT = smd 0.65 x 2.6: 1 -2.54,-1.85; 2 -2.54,1.85; 3 -1.27,-1.85; 4 -1.27,1.85; 5 0,-1.85; 6 0,1.85; 7 1.27,-1.85; 8 1.27,1.85; 9 2.54,-1.85; 10 2.54,1.85
4UCONN_20329_NARROW = smd 1 x 2: BASE@1 -0.75,-2; BASE@2 0.75,-2 | smd 0.4 x 1.35: D+ 0,0.775; D- -0.65,0.775; GND 1.3,0.775; ID 0.65,0.775; VBUS -1.3,0.775 | drill 0.8 pad 1.27 octagon: SPRT@1 -3.3,0.9; SPRT@2 3.3,0.9 | drill 0.9 pad 2.413 square: SPRT@3 -3.6,-1.9; SPRT@4 3.6,-1.9 | hole 0.7: -1.95,0; 1.95,0

### Placement (x,y rotation side)
C1  43.31,44.7 0 top
C2  8.89,11.94 90 top
C3  13.46,16.89 0 top
C4  43.31,42.93 0 top
C5  32.89,17.65 0 top
C6  20.57,18.8 270 top
C7  54.86,26.8 0 top
C8  34.42,22.99 270 top
C9  22.23,18.92 270 top
C10  23.75,18.92 90 top
C11  10.16,17.02 0 top
C12  26.67,45.21 90 top
C13  13.46,14.86 0 top
C14  51.44,20.32 90 top
C15  55.12,7.49 90 top
C16  25.27,18.92 90 top
C17  36.58,46.23 90 top
C18  53.47,7.49 270 top
C19  29.08,19.43 180 top
C20  8.51,8.51 270 top
C21  5.71,46.1 0 top
C22  17.02,46.23 270 top
C23  15.11,46.23 270 top
C24  18.92,46.23 270 top
CON1  28.07,11.56 180 top
D1  54.61,41.4 90 top
D2  54.74,13.72 90 top
I2C  63.25,26.8 270 top
IC1  23.88,45.34 270 top
IC2  27.94,15.75 90 top
IC3  54.61,34.04 270 top
L  19.68,14.73 270 top
LED1  11.94,8.13 180 top
NEOPIX  62.23,40.77 270 top
PTC1  9.14,15.11 180 top
Q1  34.92,8.76 270 top
Q4  55.24,21.72 0 top
R4  54.86,17.91 0 top
R5  34.16,10.92 0 top
R6  38.1,46.23 90 top
R8  30.73,35.05 270 top
R9  23.5,47.5 0 top
R10  18.54,17.02 270 top
R11  55.37,38.61 180 top
R12  55.5,10.79 180 top
R13  32.64,14.48 270 top
R15  16,15.49 270 top
R18  17.02,21.34 90 top
R19  25.65,42.93 180 top
R20  34.42,40.13 270 top
R21  29.08,17.91 0 top
R22  26.8,18.92 270 top
RESET  31.62,45.09 0 top
SENSE  62.23,12.83 270 top
SJ1  52.07,26.8 90 top
SJ4  24,13.59 270 top
SP1  19.05,10.03 0 top
TP7  42.55,10.54 0 top
TP8  42.55,6.86 0 top
TP9  50.93,10.54 0 top
U1  12.57,12.06 270 top
U2  28.96,39.24 270 top
U3  8.51,40.13 0 top
U4  3.94,16.64 180 top
U$2  25.65,28.07 180 top
U$7  64.26,2.67 90 top
U$9  65.53,47.37 90 top
U$11  1.27,20.83 90 top
U$15  64.26,50.55 90 top
U$16  2.54,2.67 90 top
U$17  2.54,50.55 90 top
U$19  [PYPORTALPYNT_TOP]  0,0.13 0 top
U$23  65.28,6.22 90 top
U$54  [PYPORTALPYNT_BOT]  66.8,0.13 0 bottom
U$55  64.64,26.8 270 bottom
U$63  [PCBFEAT-REV-040]  59.44,47.12 0 top
X1  16,32 270 top
X3  46.74,8.76 0 top
X4  4.7,10.29 270 top

### Tracks (layer width: path | path; a pad name or v marks a point on that pad's centre or on a via)
3.3V  (via drill 0.5)
  Top 0.305: R22.1 C16.2 25.15,19.9 25.15,20.19 | 12.51,14.38 C13.1 | 12.38,17.02 C3.1 | U1.5 14.86,12.03 14.86,10.17 | U$55.40 U$55.41 36.09,34.92 | 36.09,34.92 U$55.42 | R19.1 26.5,42.43 27.01,41.92 28.33,41.92 v29.22,41.03 31.01,41.03 | 31.01,41.03 32.15,41.03 U2.8 34.54,41.15 | v27.05,34.42 27.4,34.06 U$2.21 27.4,31.52 27.81,31.12 28.7,31.12 28.96,30.86 28.96,27.94 29.08,27.81 29.09,27.82 U$2.8 33.93,27.82 v34.18,27.57 | U$2.34 20.36,31.32 20.12,31.56 20.12,32.2 v20.19,32.28 | 31.01,41.03 31.01,43.29 28.57,45.72 26.54,45.72 25.75,45.72 IC1.5 25.18,46.67 R9.2 v26.29,47.5 | v24.26,21.08 24.26,21.46 25.4,22.6 U$2.56 25.4,24.51 25.53,24.64 28.7,24.64 28.83,24.77 28.83,25.53 29.12,25.82 U$2.4 32.98,25.82 v33.4,25.4 | U$2.48 21.03,24.32 17.98,21.27 17.98,20.52 17.53,20.07 | 34.54,41.15 35.43,41.15 v36.96,42.67 | R6.1 38.1,43.85 36.96,42.71 v36.96,42.67 | R18.1 17.14,20.36 | 36.09,34.92 36.35,34.67 v39.12,34.67 | v41.15,40.77 41.15,41.78 40.39,42.55 39.75,43.18 37.47,43.18 v36.96,42.67 | X3.1 44.2,7.83 45.24,8.87 51.92,8.87 | SJ1.3 51.94,28.19 | 51.94,28.19 51.05,28.19 50.8,27.94 50.8,24.51 51.88,23.43 | 15.61,10.17 v15.62,10.16 | 51.75,8.71 52.06,9.02 52.07,9.02 | 52.63,8.44 C18.1 53.57,8.34 C15.2 | R20.1 34.42,41.02 34.54,41.15 | U4.2_C v0.72,15.21 | Q4.5 55.24,21.84 | 55.24,21.84 Q4.2 | R4.3 R4.2 54.46,17.42 53.98,17.91 52.58,17.91 | 55.24,21.84 v57.28,21.84 | v55.63,29.59 53.72,29.59 | 53.72,29.59 53.34,29.59 51.94,28.19 | C1.1 42.32,44.57 42.32,42.89 | 53.72,29.59 53.72,34.8 54.86,35.94 IC3.8 | U3.10 U3.9 | 4.46,45.8 C21.1 4.76,46.8 | C22.1 17.34,47.5 | C23.1 14.79,47.5
  Top 0.406: C14.2 51.85,21.17 51.88,21.14 | C12.2 26.67,45.85 26.54,45.72 | 40.39,42.55 41.98,42.55 42.32,42.89 C4.1 | v33.4,25.4 34.42,24.38 C8.1
  Top 0.508: U1.5 12.51,14.38 | C13.1 C3.1 | 12.38,17.02 C11.2 11.01,19.85 10.79,20.07 | LED1.2 14.86,10.17 15.61,10.17 | 10.79,20.07 9.3,21.56 v4.77,21.56 3.81,22.53 3.81,25.91 4.21,26.3 X1.4 | R18.1 16.6,20.07 | 16.6,20.07 10.79,20.07 | 25.15,20.19 v24.26,21.08 | 17.53,20.07 16.6,20.07 | 17.14,20.36 v17.14,19.18 | 51.92,8.87 52.07,9.02 52.58,9.52 52.58,17.91 52.58,20.45 51.88,21.14 51.88,23.43 | 51.75,8.71 v51.75,7.56 52.63,8.44 | U3.10 4.46,45.8 | 4.76,46.8 5.46,47.5 14.79,47.5 | C23.1 C22.1 | 17.34,47.5 18.92,47.5 | 18.92,47.5 v20.57,47.5 | C24.1 18.92,47.5
  Bottom 0.305: v20.19,32.28 20.57,31.9 21.84,31.9 22.73,32.79 26.06,32.79 27.05,33.78 v27.05,34.42 | v33.4,25.4 33.67,25.67 33.67,27.06 v34.18,27.57 | 24.26,20.58 v24.26,21.08 | v39.12,34.67 40.36,35.92 40.36,39.98 v41.15,40.77 | v51.75,7.56 51.63,7.56 | v0.72,15.21 0.72,17.52 v4.77,21.56 | v57.28,21.84 58.17,22.73 58.17,27.18 55.75,29.59 v55.63,29.59
  Bottom 0.508: v17.14,19.18 17.65,19.18 18.16,19.68 23.37,19.68 24.26,20.58 | v15.62,10.16 16,9.78 20.45,9.78 23.5,6.73 50.8,6.73 51.63,7.56 | v20.57,47.5 21.97,47.5 | 21.97,47.5 v26.29,47.5 | 21.97,47.5 21.97,40.24 21.34,39.61 21.34,37.75 19.05,35.46 17.51,35.46 17.13,35.08 16.41,35.08 11.43,30.1 | 11.43,30.1 11.37,30.1 | 11.43,30.1 10.11,28.78 10.11,26.68 4.99,21.56 v4.77,21.56
!RESET  (via drill 0.5)
  Top 0.203: RESET.B RESET.B' C17.2 R6.2 | TP9.P$1 50.85,10.61 X3.10
  Top 0.254: v21.13,21.16 21.13,21.34 21.55,21.77 22.41,21.77 23.36,22.71 23.36,23.57 U$2.52 | v51.14,10.41 51.02,10.54 TP9.P$1 50.93,12.7 50.29,13.34 50.29,43.94 47.16,47.08 R6.2
  Bottom 0.254: v51.14,10.41 50.93,10.41 49.4,8.89 33.92,8.89 31.45,11.36 31.45,14.36 28.16,17.65 17.45,17.65 16.26,18.84 16.26,19.94 17.48,21.16 v21.13,21.16 | v21.13,21.16
+5V  (via drill 0.5)
  Top 0.305: C5.1 31.94,15.93 R13.1 R13.2 R13.3 R13.4 30.38,13.18 v30.23,13.34 | PTC1.1 11.27,14.38 U1.1 10.22,13.02 10.16,12.95 10.16,11.12 10.03,10.99 | 10.03,10.99 11.15,10.99 U1.3 11.27,10.32 v11.81,9.78 | 10.03,10.99 C2.1 8.51,10.61 C20.1 | v25.02,15.88 26.51,15.88 IC2.5 | v53.34,22.1 53.34,23.75 52.07,25.02 SJ1.1
  Bottom 0.305: v11.81,9.78 12.19,9.78 18.29,15.88 v25.02,15.88 27.69,15.88 v30.23,13.34 30.23,11.18 33.4,8 50.04,8 55.63,13.59 55.63,20.19 53.72,22.1 v53.34,22.1
AUDIO_OUT
  Top 0.254: U$2.3 32.34,25.32 33.15,24.51 33.15,21.46 | 33.15,21.46 31.11,19.43 C19.1 | 33.15,21.46
CARDDET  (via drill 0.5)
  Top 0.254: U$2.2 30.15,24.77 31.78,24.77 v32.02,24.53 | v18.67,23.19 18.67,23.55 18.31,23.91 18.31,23.93 17.85,24.38 15.94,24.38 X1.CD2
  Bottom 0.254: v32.02,24.53 31.24,24.53 30.62,24.53 28.7,22.61 21.46,22.61 20.88,23.19 v18.67,23.19 | v32.02,24.53
D3
  Top 0.254: R12.1 59.5,10.79 SENSE.3
D3_UNSAFE  (via drill 0.5)
  Top 0.254: U$2.13 32.73,30.32 32.82,30.4 32.82,34.62 33.56,35.37 v34.12,35.37 | D2.C 54.74,10.88 R12.2 55.8,9.65 v57.02,9.65
  Bottom 0.254: v34.12,35.37 38.67,35.37 39.75,36.45 39.75,41.15 41.66,43.05 51.18,43.05 61.47,32.77 61.47,13.34 57.78,9.65 v57.02,9.65
D4
  Top 0.254: NEOPIX.3 59.37,38.61 R11.1
D4_UNSAFE  (via drill 0.5)
  Top 0.254: U$2.14 31.96,30.82 32.26,31.12 32.26,34.76 34.07,36.58 v34.58,36.58 | v56.26,40.13 D1.C 54.61,38.7 R11.2
  Bottom 0.254: v34.58,36.58 34.58,36.18 34.92,35.85 38.5,35.85 39.11,36.45 39.11,41.15 41.47,43.51 43.38,43.51 43.43,43.56 43.48,43.51 51.37,43.51 54.75,40.13 v56.26,40.13
D13
  Top 0.254: U$2.50 22.4,23.09 22.15,22.84 20.88,22.84 18.92,20.88 18.92,18.25 R10.1
D+  (via drill 0.5)
  Top 0.254: U$2.46 20.76,25.32 20.13,24.69 19.65,24.69 19.39,24.43 19.26,24.43 v19.14,24.3 | v7.11,10.45 7.11,10.32 7.08,10.29 X4.D+
  Bottom 0.254: v19.14,24.3 15.67,24.3 8.26,16.89 8.26,10.96 7.75,10.45 v7.11,10.45
D-  (via drill 0.5)
  Top 0.254: v7.37,11.81 6.49,10.94 X4.D- | v18.03,25.15 19.81,25.15 20.48,25.82 U$2.45
  Bottom 0.254: v7.37,11.81 7.62,12.06 7.62,16.89 15.88,25.15 v18.03,25.15
ESP_BUSY  (via drill 0.5)
  Top 0.254: U$2.39 16.48,28.82 16.41,28.75 13.44,28.75 9.88,32.31 v9.63,32.31 | U3.7 7.75,44.55 7.75,44.98 8.37,45.59 12.37,45.59 v12.52,45.74
  Bottom 0.254: v9.63,32.31 10.62,32.31 14.38,36.07 14.38,44.9 13.66,45.61 12.65,45.61 v12.52,45.74
ESP_CS  (via drill 0.5)
  Top 0.254: v20.95,46.23 20.95,46.74 21.72,47.5 R9.1 22.64,46.36 IC1.1 | v20.57,40.13 21.32,39.39 21.32,37.62 24.4,34.54 U$2.27 | v15.75,40.01 13.51,40.01 U3.28
  Bottom 0.254: v20.95,46.23 21.34,45.85 21.34,40.89 v20.57,40.13 15.88,40.13 v15.75,40.01
ESP_GPIO0  (via drill 0.5)
  Top 0.254: v15.62,38.73 14.17,38.73 14.1,38.81 13.7,38.81 U3.27 | v20.32,38.35 20.13,38.16 23.9,34.39 U$2.28
  Bottom 0.254: v20.32,38.35 19.94,38.73 v15.62,38.73
ESP_MISO
  Top 0.254: IC1.2 22.07,45.34 20.54,43.81 13.9,43.81 U3.1
ESP_RESET  (via drill 0.5)
  Top 0.254: U$2.40 17.32,28.32 17.07,28.07 13.32,28.07 | 13.32,28.07 11.29,30.1 8.89,30.1 7.46,31.53 U3.19 | 13.32,28.07 14.48,26.91 14.48,22.1 14.73,21.84 v15.24,21.84 | v14.86,18.54 14.86,18.41 16,17.27 R15.1
  Bottom 0.254: v15.24,21.84 14.99,21.59 14.99,18.67 v14.86,18.54
ESP_RTS
  Top 0.254: U$2.32 21.34,33.08 11.2,33.08 9.65,34.62 9.65,35.81 U3.21
GND  (via drill 0.5)
  Top 0.254: U$2.7 26.4,27.32 U$2.EXP | U$2.22 26.9,29.32 U$2.EXP | U$2.54 24.4,26.82 U$2.EXP | U$2.47 22.4,24.82 U$2.EXP | U$55.8 U$55.9 35.31,18.55 34.92,18.16 | U$55.8 U$55.7 | C12.1 26.16,44.87 26.16,45.09 26.05,45.19 26.03,45.19 26.02,45.21 v24,45.21 | U$55.48 37.54,38.05 v37.72,38.23 | U$55.50 36.9,39.05 v37.72,38.23 | U$55.49 37.4,38.55 v37.72,38.23 | U$55.7 34.92,17.55 | 34.92,17.55 33.95,17.55 C5.2 | U$55.8 35.04,18.05 34.92,18.16 | 34.92,18.16 34.92,17.55 | U$55.6 36.06,17.02 34.92,17.02 34.92,17.55 | U$55.7 37.32,17.55 37.97,16.89 v37.97,16.64 | 2.65,31.6 X1.MT1
  other vias: 32.64,43.05 28.19,44.58 40.51,28.45 40.39,22.86 12.57,12.06 11.94,8 18.92,7.87 19.18,12.7 12.45,18.8 7.87,19.05 25.78,26.92 25.7,36.37 32,36.32 22.48,16.76 22.23,14.86 59.05,31.24 64.14,30.86 53.85,25.27 0.76,31.62 2.41,30.23 6.99,28.45 11.81,23.75 13.72,30.1 11.43,27.18 59.56,16.26 55.88,12.19 51.56,17.14 53.59,14.99 51.94,30.61 18.92,42.67 6.22,42.67 6.22,41.4 6.22,40.13 6.22,38.86 6.22,37.59 8.13,42.67 10.67,42.67 10.67,37.59 8.13,37.59 20.45,45.09 13.59,46.48 15.9,42.01 18.52,37.8 15.62,37.49 8.13,46.48 4.19,47.75 10.79,46.48 8.89,33.55 6.1,34.44 4.32,34.44 4.32,32.66 6.1,32.66 9.27,31.14
  pour Top: 3.68,48.39 3.68,32.26 0,32.26 0,5.21 66.8,5.21 66.8,48.39
  pour Bottom: 3.68,48.39 3.68,32.26 0,32.26 0,5.21 66.8,5.21 66.8,48.39
LCD_DATA0  (via drill 0.5)
  Top 0.254: U$2.35 19.35,30.82 v19.05,31.12 | v38.1,30.73 37.41,30.05 U$55.32
  Bottom 0.254: v38.1,30.73 37.91,30.54 36.7,31.75 23.19,31.75 21.98,30.54 19.56,30.54 19.05,31.04 v19.05,31.12
LCD_DATA1  (via drill 0.5)
  Top 0.254: U$2.36 18.74,30.32 v17.94,31.12 | v40.13,30.23 38.95,30.23 38.32,29.59 36.84,29.59 36.83,29.58 36.12,29.58 U$55.31
  Bottom 0.254: v17.94,31.12 17.94,30.73 18.72,29.95 22.04,29.95 23.38,31.29 36.4,31.29 37.74,29.95 38.68,29.95 38.95,30.23 v40.13,30.23
LCD_DATA2  (via drill 0.5)
  Top 0.254: v16.83,31.26 16.83,31.12 18.13,29.82 U$2.37 | U$55.30 36.12,29.08 38.45,29.08 38.71,29.34 v39.37,29.34
  Bottom 0.254: v16.83,31.26 16.83,31.12 18.58,29.37 22.1,29.37 23.57,30.84 36.21,30.84 37.71,29.34 38.99,29.34 v39.37,29.34 | v39.37,29.34
LCD_DATA3  (via drill 0.5)
  Top 0.254: U$2.38 17.52,29.32 17.13,29.71 v17.01,29.71 | v38.81,28.33 38.59,28.55 | v38.81,28.33 38.59,28.55 | 38.59,28.55 | v38.81,28.33 38.59,28.55 | 38.59,28.55 U$55.29
  Bottom 0.254: v17.01,29.71 17.09,29.71 18.01,28.78 22.29,28.78 23.89,30.38 36.02,30.38 38.07,28.33 v38.81,28.33
LCD_DATA4  (via drill 0.5)
  Top 0.254: U$55.28 37.98,28.05 38.49,27.54 39.51,27.54 v39.62,27.43 | v16.27,26.92 16.65,26.92 17.54,27.82 U$2.41
  Bottom 0.254: v39.62,27.43 39.51,27.54 38.21,27.54 35.83,29.92 24.08,29.92 22.48,28.32 18.05,28.32 16.65,26.92 v16.27,26.92
LCD_DATA5  (via drill 0.5)
  Top 0.254: U$2.42 20.95,27.32 18.28,27.32 v17.92,26.96 | v39.62,26.32 38.86,27.09 38.3,27.09 37.84,27.55 U$55.27 | U$2.42
  Bottom 0.254: v39.62,26.32 39.46,26.32 38.7,27.09 38.02,27.09 35.64,29.46 24.27,29.46 22.67,27.87 18.83,27.87 v17.92,26.96
LCD_DATA6  (via drill 0.5)
  Top 0.254: U$2.43 18.89,26.82 18.01,25.94 17.25,25.94 v17.12,26.07 | v38.37,26.3 37.63,27.05 U$55.26
  Bottom 0.254: v17.12,26.07 17.25,25.94 18.01,25.94 19.48,27.41 22.86,27.41 24.46,29.01 35.45,29.01 38.15,26.3 v38.37,26.3
LCD_DATA7  (via drill 0.5)
  Top 0.254: U$55.25 36.86,26.55 37.65,25.76 v37.65,25.38 | U$2.44 19.61,26.32 19.44,26.15 v19.24,25.94 | v19.24,25.94
  Bottom 0.254: v19.24,25.94 20.25,26.95 23.05,26.95 24.65,28.55 34.88,28.55 37.65,25.79 v37.65,25.38
LEDK
  Top 0.254: Q1.C 36.09,8.83 U$55.1
LIGHT  (via drill 0.5)
  Top 0.254: R8.2 30.73,32.83 30.58,32.67 | U$2.16 30.58,32.29 30.58,32.67 | U4.1_E 5.74,19.07 v6.86,20.19 | 30.58,32.67 v30.58,32.91
  Bottom 0.254: v30.58,32.91 29.88,32.21 23,32.21 22.04,31.25 20.12,31.25 18.98,32.38 15.51,32.38 14.87,31.74 14.87,29.34 6.86,21.34 v6.86,20.19
MISO  (via drill 0.5)
  Top 0.254: U$2.31 22.36,32.56 22.36,33.37 21.8,33.92 v21.35,33.92 | IC1.4 24.29,44.39 23.5,43.6 v23.5,43.43 | X1.7 11.04,29.6 11.68,28.96 v11.68,28.45
  Bottom 0.254: v23.5,43.43 23.62,43.31 23.62,39.09 23.97,38.74 23.97,37.71 23.62,37.36 23.62,36.2 v21.35,33.92 20.98,33.92 20.23,33.18 15.65,33.18 11.68,29.21 v11.68,28.45
MOSI  (via drill 0.5)
  Top 0.254: v7.11,25.53 6.79,25.2 X1.3 | U$2.29 23.4,34.02 21.48,35.94 19.43,35.94 | U3.31 16.55,42.88 19.3,40.13 19.3,36.07 19.43,35.94 | 19.43,35.94 19.3,35.94 19.3,36.55 v18.41,36.55
  Bottom 0.254: v18.41,36.55 17.78,36.55 16.89,35.66 16.1,35.66 9.53,29.08 9.53,26.92 8.13,25.53 v7.11,25.53
N$1
  Top 0.254: U$55.5 36.06,16.52 34.77,16.52 34.02,15.77 33.5,15.77 R13.8
N$2
  Top 0.254: U$55.2 35.24,15.05 35.05,14.86 35.05,13.72 34.51,13.18 R13.5
N$3
  Top 0.254: U$55.3 36.06,15.52 35.06,15.52 34.59,15.05 34.59,14.78 33.89,14.08 R13.6
N$4
  Top 0.254: U$55.4 36.06,16.02 34.91,16.02 33.78,14.88 R13.7
N$5
  Top 0.254: 52.07,26.54 52.07,25.65
N$8
  Top 0.254: L.A 18.64,16.07 R10.2
N$10
  Top 0.254: C19.2 R21.1
N$11
  Top 0.254: IC2.3 29.93,17.39 R21.2
N$13
  Top 0.305: SJ4.2 SP1.-
N$16
  Top 0.254: Q1.B 33.95,9.71 35.01,10.77 R5.2
NEOPIX
  Top 0.254: U$2.49 21.02,23.62 18.47,21.07 18.47,19.36 17.65,18.54 17.65,10.29 16.13,8.76 15.2,8.76 LED1.1
QSPI_CS
  Top 0.254: U$2.24 25.9,33.81 25.81,33.9 25.81,35.07 24,36.88 24,40.77 24.26,41.02 25.51,41.02 U2.1
  Top 0.305: R19.2 24.8,41.15 U2.1
QSPI_DATA[0]
  Top 0.254: U$2.17 29.4,36.63 30.11,37.34 U2.5
QSPI_DATA[1]
  Top 0.254: U$2.18 28.9,38.15 27.18,39.88 U2.2
QSPI_DATA[2]
  Top 0.254: U$2.19 28.4,37.76 27.56,38.61 U2.3
QSPI_DATA[3]  (via drill 0.5)
  Top 0.254: v27.49,37.44 27.9,37.03 U$2.20 | U2.7 32.23,39.92 v28.62,39.92
  Bottom 0.254: v27.49,37.44 27.49,38.46 28.62,39.59 v28.62,39.92
QSPI_SCK  (via drill 0.5)
  Top 0.254: U$2.23 26.4,33.96 26.27,34.09 26.27,35.41 v27.05,36.2
  Top 0.305: v29.35,38.81 32.06,38.81 U2.6
  Bottom 0.305: v27.05,36.2 27.52,36.2 28.56,37.24 28.56,37.83 29.35,38.62 v29.35,38.81
RXD  (via drill 0.48, 0.5)
  Top 0.254: U$2.26 24.9,33.52 24.9,34.69 22.73,36.85 v22.73,38.23 | U3.22 10.46,34.63 11.3,33.78 19.74,33.78 v20.11,34.15
  Bottom 0.254: v22.73,38.23 22.73,36.78 v20.11,34.15
SCK  (via drill 0.5)
  Top 0.254: U$2.30 22.9,33.61 21.08,35.43 17.65,35.43 16.64,36.45 v16.64,36.7 16.64,40.22 15.73,41.13 U3.29 | v8.51,27.3 8.41,27.4 X1.5
  Bottom 0.254: v8.51,27.3 8.51,28.75 16.46,36.7 v16.64,36.7
SCL
  Top 0.254: Q4.3 56.16,20.65 R4.5 59.55,22.14 I2C.4
SCL_3V  (via drill 0.5)
  Top 0.254: U$2.64 29.65,23.37 v30.73,23.37 | R4.6 55.26,18.14 55.5,17.91 57.15,17.91 62.23,22.99 62.23,24.51 61.85,24.89 56.61,24.89 55.94,24.22 v55.94,23.98 55.94,22.67 Q4.4 | IC3.6 57.08,33.53 55.5,33.53 v55.37,33.4
  Bottom 0.254: v30.73,23.37 31.11,23.37 34.16,20.32 41.15,20.32 41.78,19.68 41.78,11.94 42.8,10.92 49.15,10.92 50.29,12.06 50.29,24.38 50.42,24.38 | v55.94,23.98 55.54,24.38 50.42,24.38 | v55.37,33.4 52.7,33.4 50.42,31.12 50.42,24.38
SD_CS  (via drill 0.5)
  Top 0.254: X1.2 8.66,24.1 11.85,20.92 15.75,20.92 R18.2 17.14,22.19 v17.14,23.5 | U$2.59 26.9,22.35 26.9,22.34 27.64,21.6 v27.64,20.97
  Bottom 0.254: v27.64,20.97 27.64,21.6 27.14,22.1 18.54,22.1 v17.14,23.5
SDA
  Top 0.254: R4.8 53.21,19.11 53.21,20.7 54.49,21.98 Q4.6 54.49,23.76 56.28,25.54 59.29,25.54 I2C.3
SDA_3V  (via drill 0.5)
  Top 0.254: U$2.63 28.95,23.57 28.95,23.15 29.56,22.53 31.24,22.53 31.88,21.89 v31.88,21.39 | R4.7 54.46,19.81 | 54.46,19.81 54.46,20.79 Q4.1 | 54.46,19.81 54.4,19.88 v54.01,19.88 | v55.12,31.37 55.12,31.44 55.81,32.13 IC3.5
  Bottom 0.254: v31.88,21.39 33.4,19.86 40.89,19.86 41.33,19.43 41.33,11.75 42.61,10.46 49.34,10.46 50.75,11.88 50.75,19.31 50.9,19.46 | v54.01,19.88 53.86,19.73 51.16,19.73 50.9,19.46 | 50.9,19.46 50.9,22.7 51.94,23.75 54.86,23.75 55.5,23.11 56.39,23.11 56.77,23.5 56.77,24.32 56.77,26.16 53.59,29.34 53.59,29.97 54.99,31.37 v55.12,31.37
SPK_SD
  Top 0.254: U$2.51 22.9,22.9 22.23,22.23 21.08,22.23 19.43,20.57 19.43,16.1 19.66,15.88 23.88,15.88 24.77,16.76 26.64,16.76 26.64,17.92 R22.2
  Top 0.305: IC2.4 26.64,16.76
SPKR+
  Top 0.305: IC2.1 28.69,14.25 CON1.2 28.69,9.01 26.92,7.23 SP1.+
SPRK-
  Top 0.305: CON1.1 27.44,14 IC2.6 24.45,14.8 SJ4.1
SWCLK  (via drill 0.5)
  Top 0.254: TP8.P$1 42.55,8.38 43.05,8.89 | X3.4 45.47,9.78 44.58,8.89 43.05,8.89 | U$2.57 25.9,21.79 25.76,21.64 25.76,21.61 v25.44,21.29 | v38.04,9.84 38.99,8.89 43.05,8.89
  Bottom 0.254: v25.44,21.29 25.44,21.22 26.14,20.52 26.14,20.51 31.91,14.74 31.91,11.62 33.88,9.64 37.84,9.64 v38.04,9.84
SWDIO  (via drill 0.5)
  Top 0.254: U$2.58 26.4,21.46 v26.56,21.3 | TP7.P$1 41.78,9.78 v41.27,9.78
  Top 0.305: X3.2 42.62,10.61 TP7.P$1
  Bottom 0.254: v26.56,21.3 26.85,21.01 26.85,20.63 32.36,15.12 32.36,11.87 33.44,10.79 40.26,10.79 v41.27,9.78
TFT_BACKLITE  (via drill 0.5)
  Top 0.254: U$2.60 27.4,22.51 28.83,21.08 v28.83,20.7 | v33.15,12.19 33.31,12.03 R5.1
  Bottom 0.254: v33.15,12.19 33.15,16.64 29.08,20.7 v28.83,20.7
TFT_CS  (via drill 0.5)
  Top 0.254: U$2.9 33.93,28.32 34.67,29.06 34.67,32.51 35.21,33.05 U$55.38 38,33.05 38.3,33.35 v38.3,33.78 | R20.2 34.84,39.28 35.31,39.75 37.47,39.75 37.85,39.37 v41.19,39.37
  Bottom 0.254: v38.3,33.78 39.7,33.78 41.02,35.1 41.02,39.2 v41.19,39.37
TFT_RD  (via drill 0.5)
  Top 0.254: U$55.35 36.12,31.58 38.2,31.58 38.71,32.09 39.16,32.09 v39.24,32 | v34.67,25.89 34.27,25.89 33.84,26.31 32.68,26.31 32.67,26.32 U$2.5
  Bottom 0.254: v39.24,32 39.62,31.62 40.77,31.62 41.53,30.86 41.53,25.15 40.89,24.51 36.05,24.51 v34.67,25.89
TFT_RESET  (via drill 0.5)
  Top 0.254: U$2.1 31.12,24.32 32.07,23.37 v32.26,23.37 | v37.85,21.84 37.85,19.68 37.21,19.05 U$55.10 | v32.26,23.37
  Bottom 0.254: v32.26,23.37 34.04,23.37 35.31,22.1 37.85,22.1 v37.85,21.84
TFT_RS
  Top 0.254: U$55.37 36.06,32.52 35.35,32.52 35.16,32.32 35.16,27.38 34.55,26.77 32.87,26.77 32.82,26.82 U$2.6
TFT_TE
  Top 0.254: U$2.10 33.77,28.82 34.21,29.26 34.21,32.7 35.03,33.52 35.43,33.52 35.47,33.55 U$55.39
TFT_WR  (via drill 0.5)
  Top 0.254: U$2.12 33.12,29.82 33.27,29.97 33.27,33.78 v33.78,34.29 | v40.11,32.88 38.84,32.88 38.02,32.05 U$55.36
  Bottom 0.254: v33.78,34.29 36.32,34.29 37.74,32.88 v40.11,32.88
TOUCH_XL  (via drill 0.5)
  Top 0.254: U$55.46 40.55,37.05 42.04,35.56 42.04,20.95 v40.13,19.05 | U$2.62 28.4,23.03 29.45,21.98 30.5,21.98 v30.75,21.73
  Bottom 0.254: v30.75,21.73 31.08,21.4 31.08,20.73 33.66,18.16 37.34,18.16 38.23,19.05 v40.13,19.05
TOUCH_XR
  Top 0.254: U$2.11 33.51,29.32 33.73,29.54 33.73,32.9 34.95,34.12 34.95,35.71 35.28,36.05 U$55.44
TOUCH_YD  (via drill 0.5)
  Top 0.254: U$2.61 27.9,22.77 29.21,21.46 29.72,21.46 30.1,21.08 v30.1,20.83 | U$55.45 40.16,36.55 41.53,35.18 41.53,21.84 39.35,19.66 39.35,18.13 v38.99,17.77
  Bottom 0.254: v38.99,17.77 38.1,17.77 37.72,17.39 33.54,17.39 v30.1,20.83 | v30.1,20.83
TOUCH_YU
  Top 0.254: U$2.15 31.32,31.32 31.75,31.75 31.75,34.92 34.37,37.55 U$55.47
TXD  (via drill 0.48, 0.5)
  Top 0.254: U$2.25 25.36,32.56 25.36,33.71 25.35,33.71 25.35,34.88 23.55,36.69 23.55,38.79 v22.84,39.5 | v19.02,34.56 18.7,34.24 12.32,34.24 11.46,35.1 U3.23
  Bottom 0.254: v22.84,39.5 21.95,38.61 21.95,37.53 19.02,34.6 v19.02,34.56
VBUS
  Top 0.305: X4.VBUS 5.49,11.59 7.74,13.84 PTC1.2
VCC
  Top 0.305: SJ1.2 C7.1 53.91,27.5 54.48,28.07 58.9,28.07 59.04,27.92 | 59.42,27.92 I2C.2 | R4.1 53.56,16.41 53.85,16.13 55.88,16.13 56.16,16.41 R4.4
  Top 0.406: NEOPIX.2 62.1,40.77 62.74,40.13 62.74,37.97 61.85,37.08 61.85,31.5 62.61,30.73 62.61,28.32 62.21,27.92 | 55.88,16.13 55.88,13.97 57.02,12.83 SENSE.2 62.1,12.83 62.48,13.21 62.48,15.62 61.98,16.13 61.98,21.6 62.89,22.51 62.89,27.25 62.21,27.92 | 62.21,27.92 59.42,27.92 59.04,27.92
VDDCORE
  Top 0.254: C9.1 22.2,19.75 C6.1
  Top 0.305: C10.2 C9.1 22.23,20.57 23.9,22.25 U$2.53